# EAGLE design micromouse_board_revB_V0.0.8 (EAGLE 9.4.2)
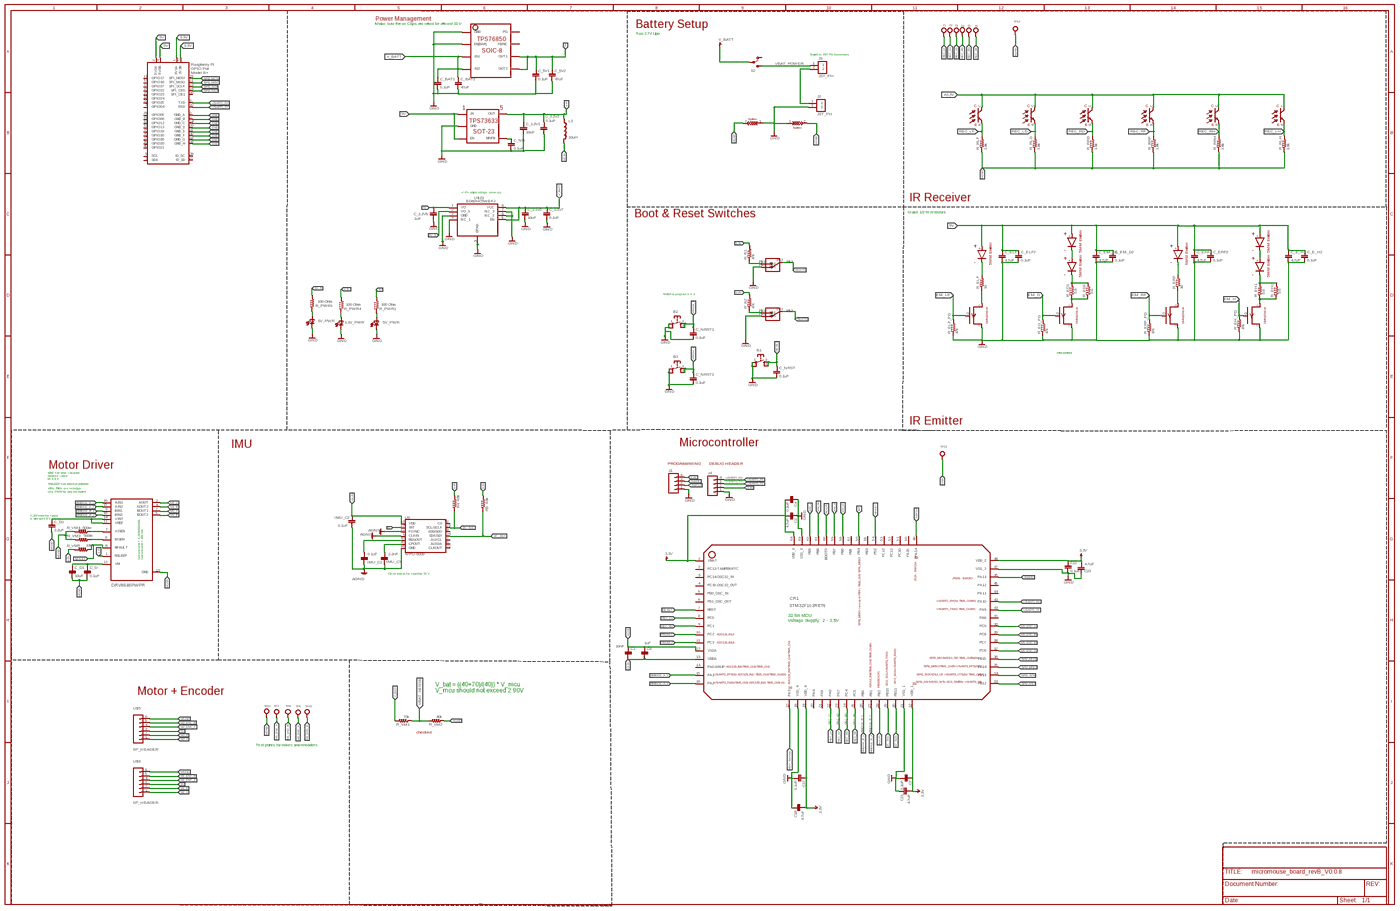
[diagram p0: schematic, sheet 1, overview]
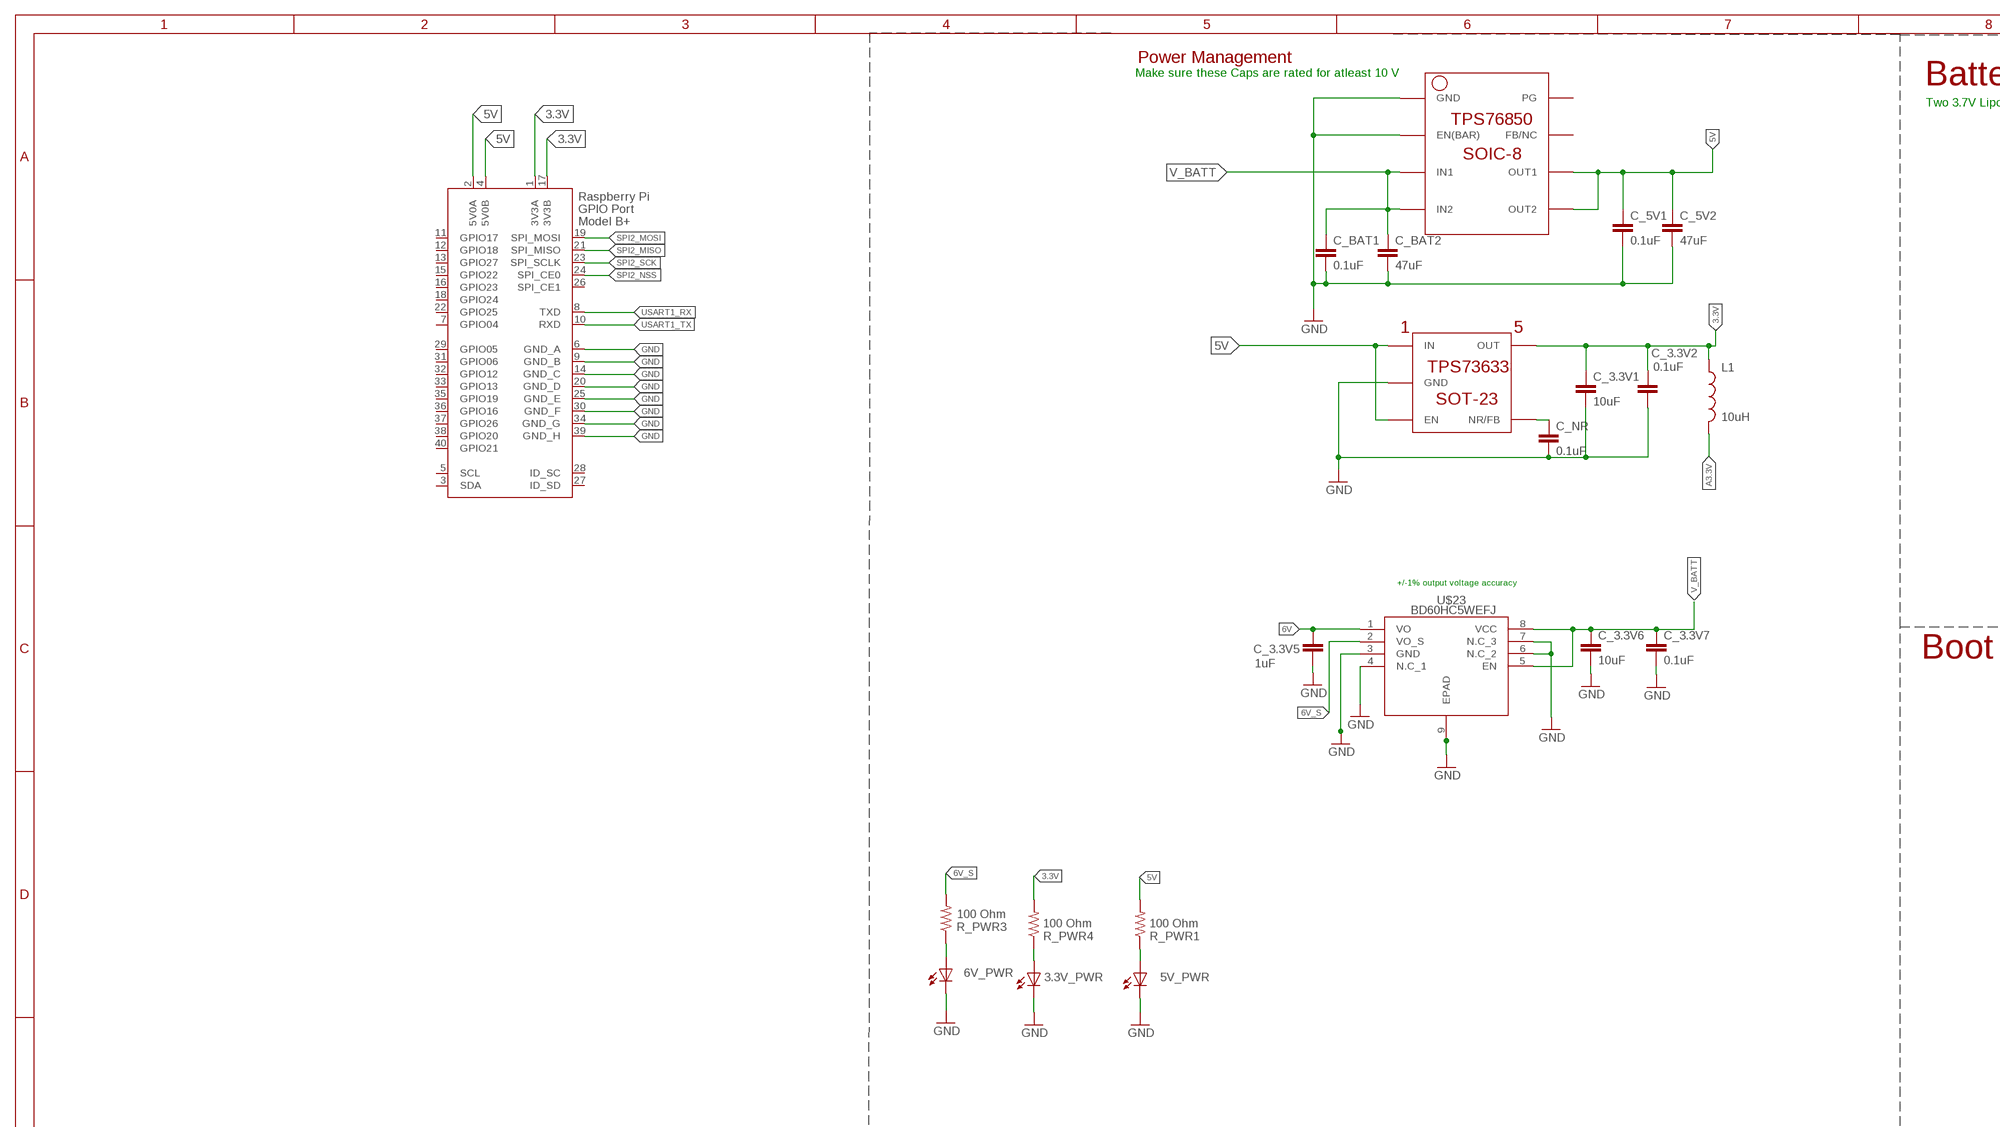
[diagram p1: schematic, sheet 1, part 1 of 4]
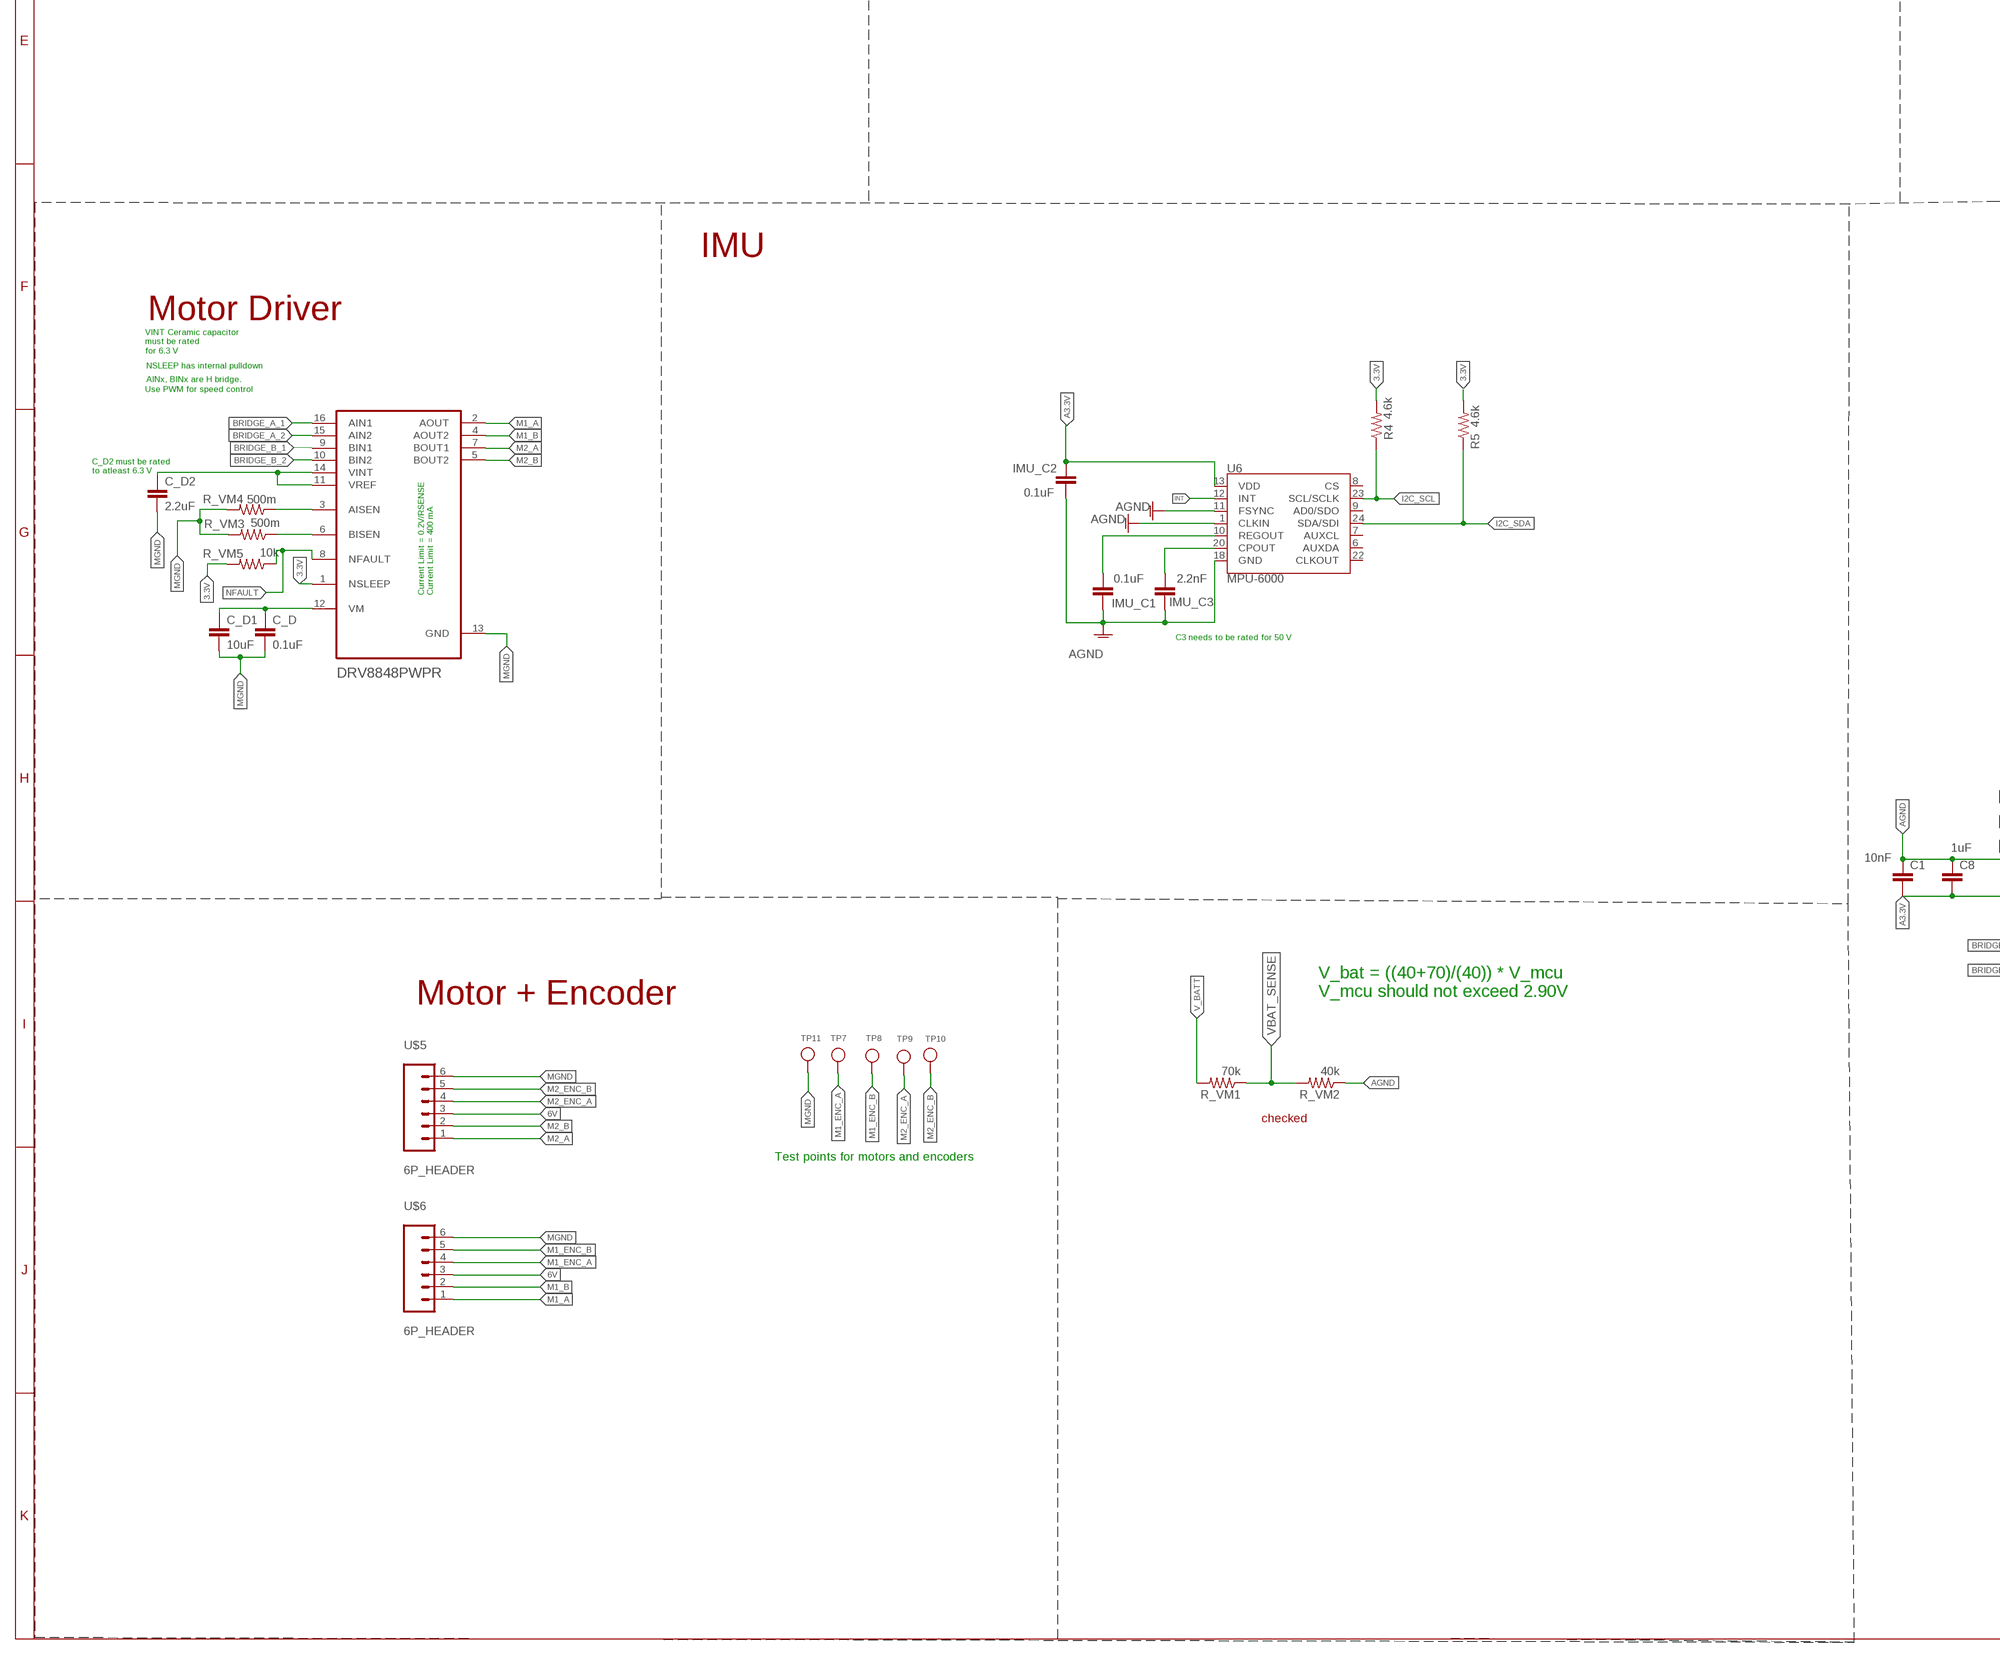
[diagram p2: schematic, sheet 1, part 2 of 4]
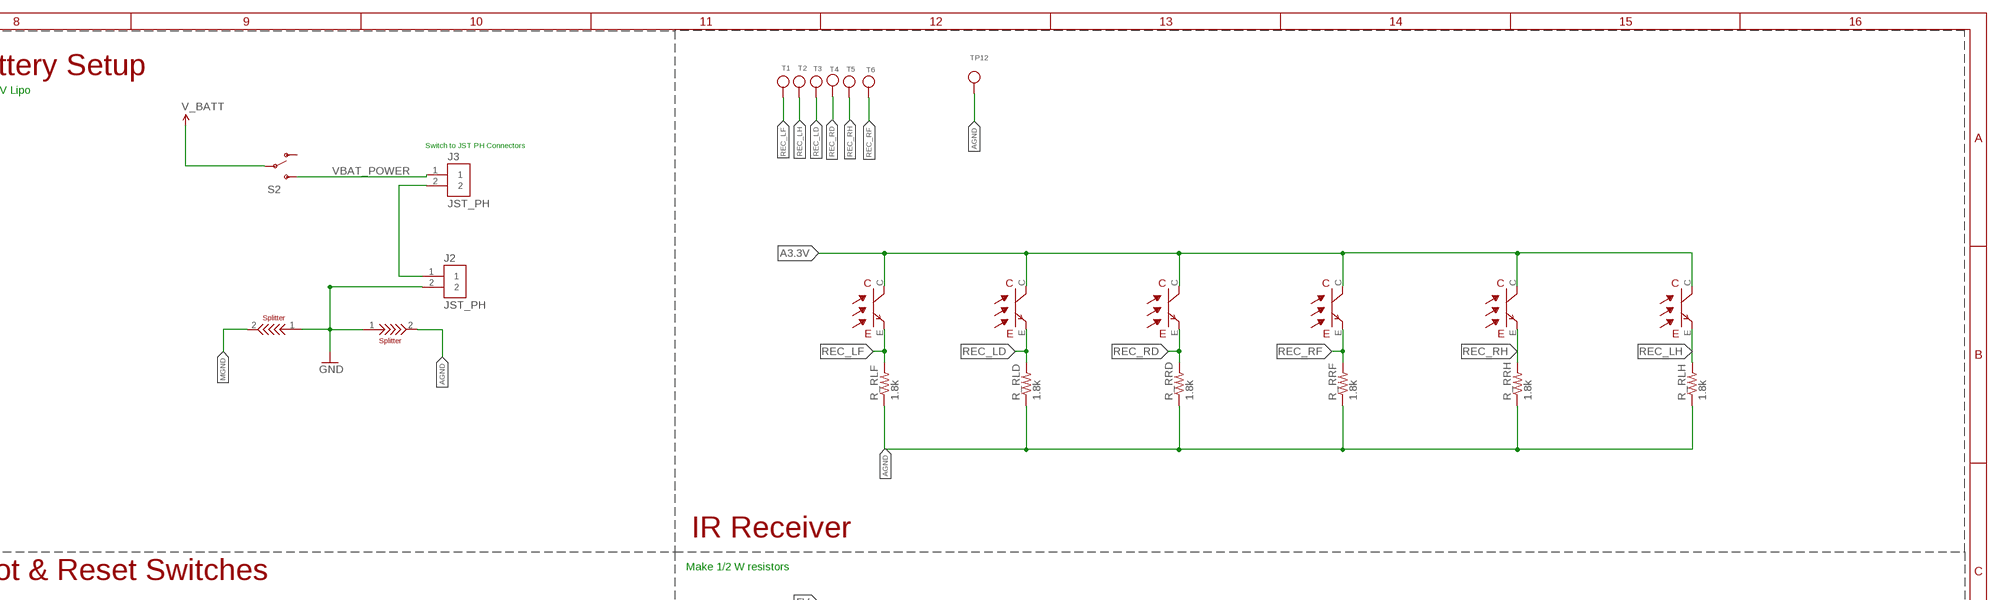
[diagram p3: schematic, sheet 1, part 3 of 4]
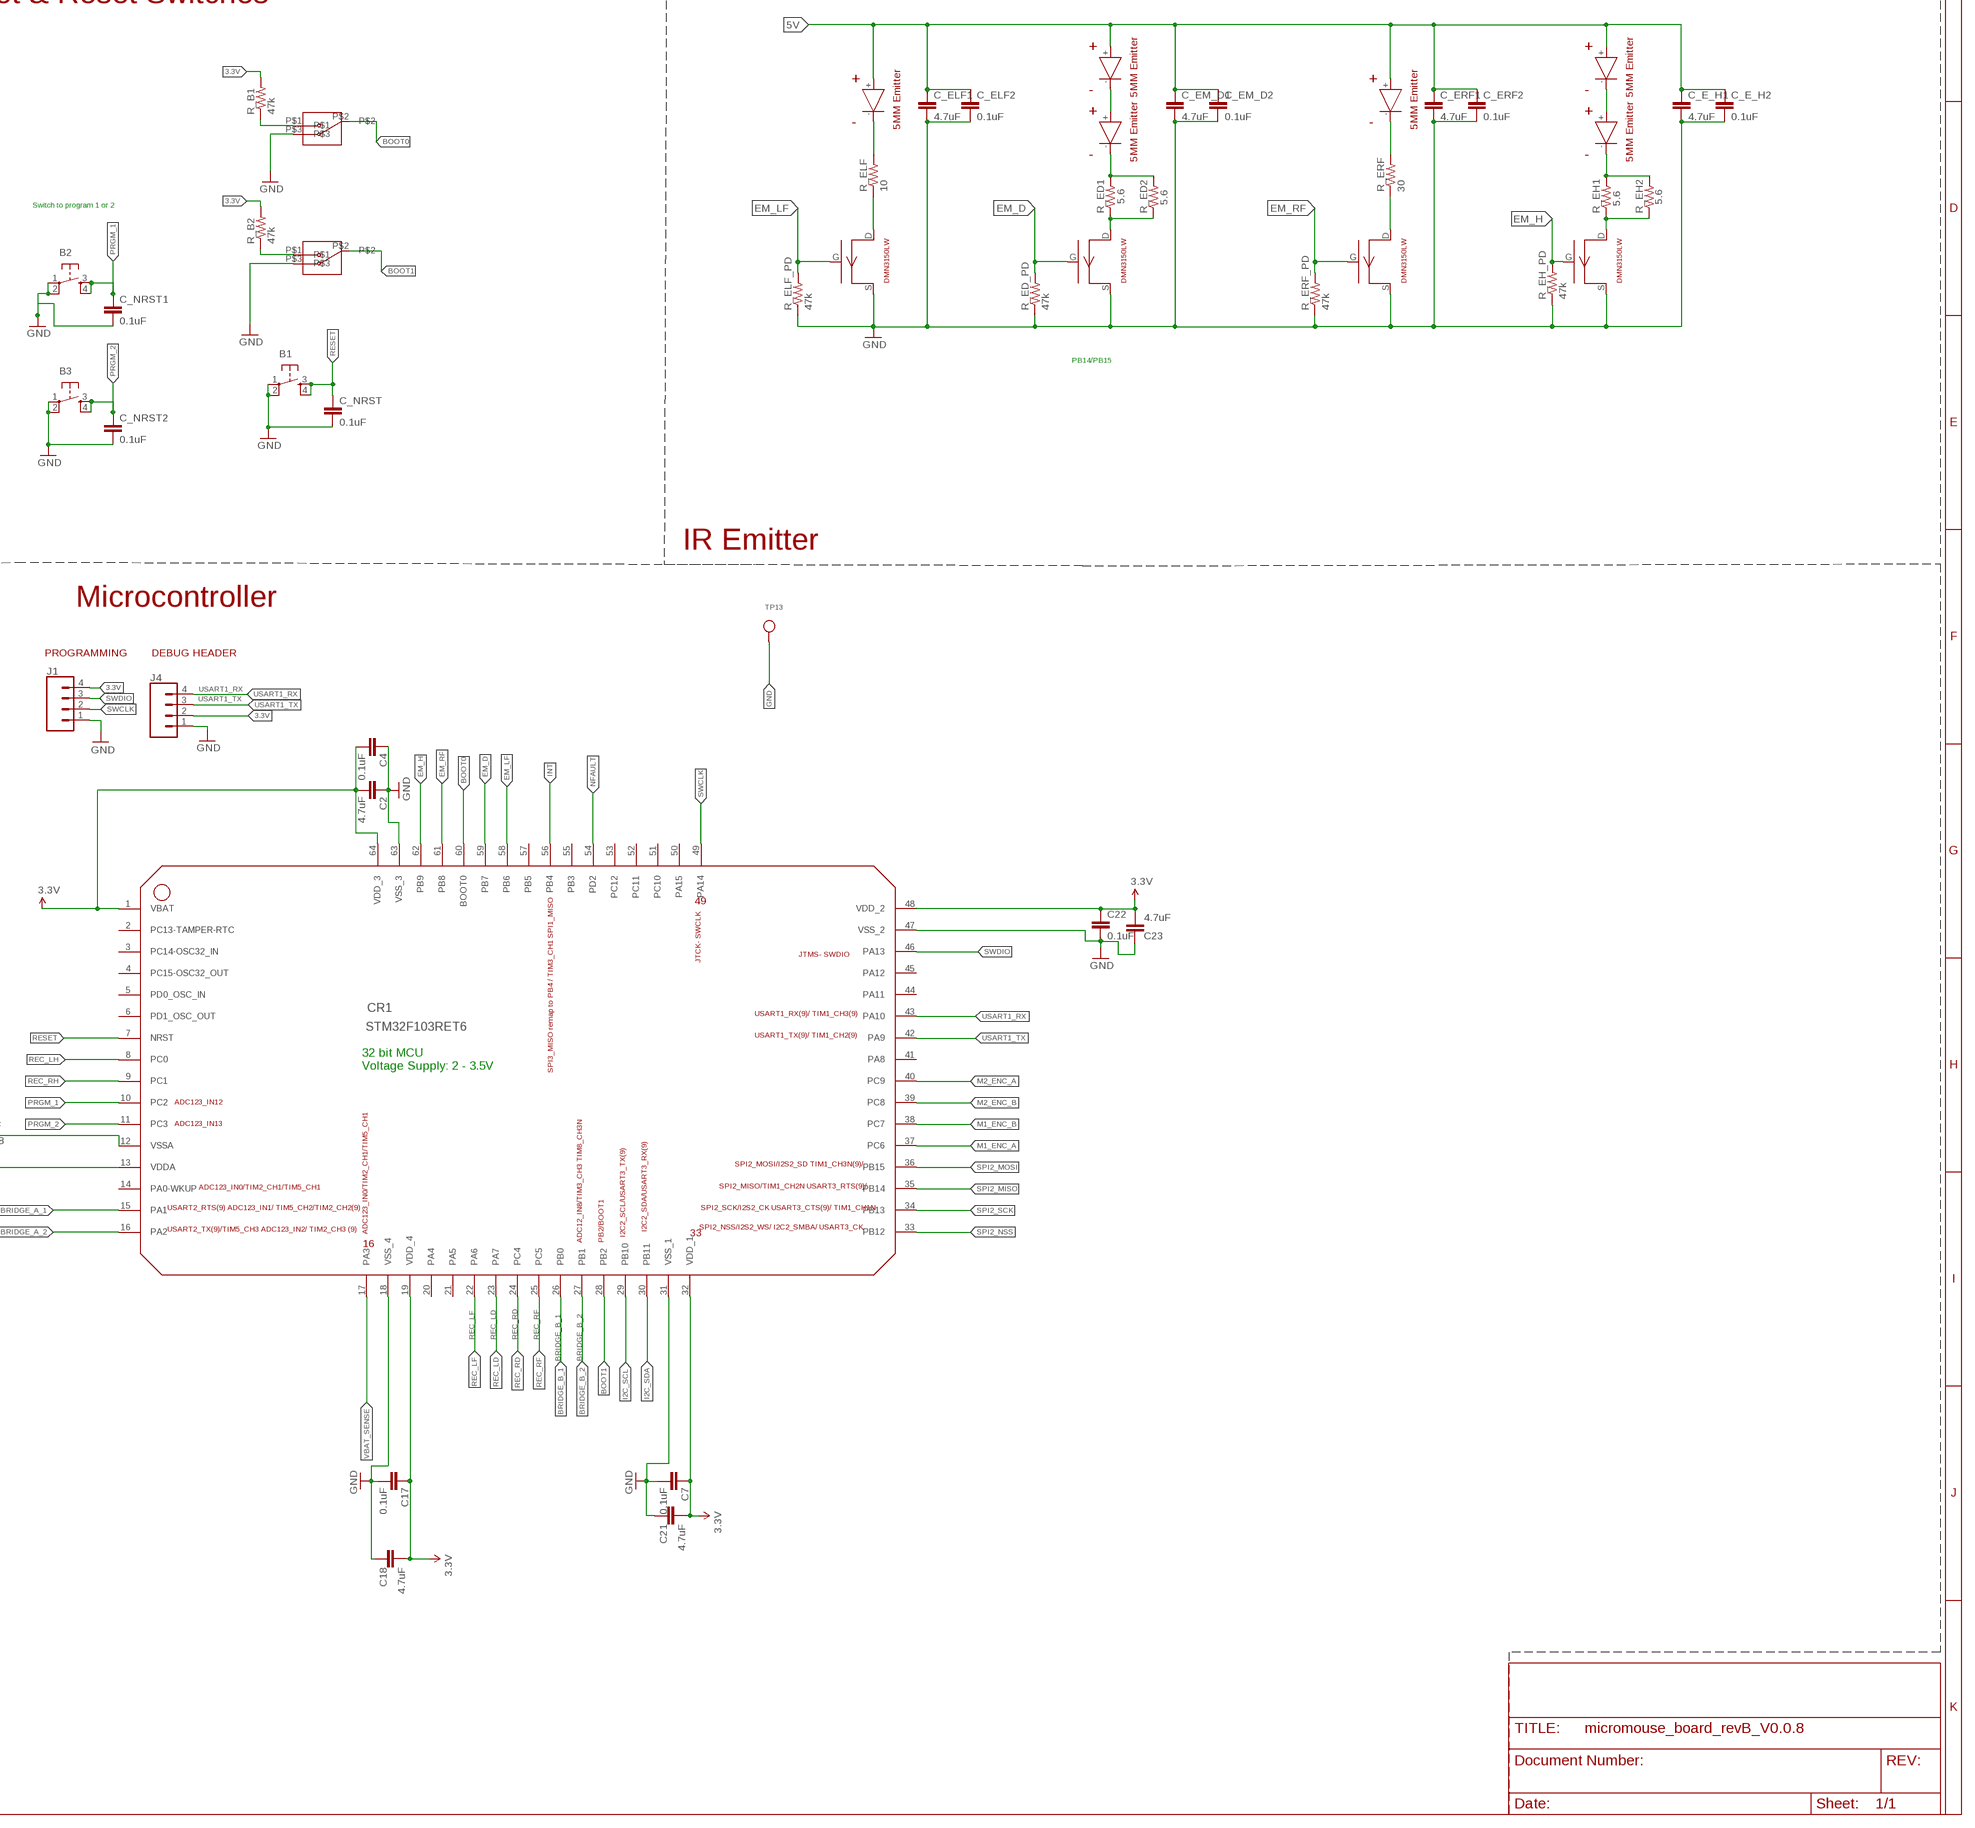
[diagram p4: schematic, sheet 1, part 4 of 4]

## Parts
3.3V_PWR  green  LED1206  [LED-1206]
5V_PWR  green  LED1206  [LED-1206]
6V_PWR  green  LED1206  [LED-1206]
B1  TAC_SWITCHSMD  [TACTILE-SWITCH-SMD]
B2  TAC_SWITCHSMD  [TACTILE-SWITCH-SMD]
B3  TAC_SWITCHSMD  [TACTILE-SWITCH-SMD]
C1  10nF  CAP0603-CAP  [0603-CAP]
C2  4.7uF  CAP0603-CAP  [0603-CAP]
C4  0.1uF  CAP0603-CAP  [0603-CAP]
C7  0.1uF  CAP0603-CAP  [0603-CAP]
C8  1uF  CAP0603-CAP  [0603-CAP]
C17  0.1uF  CAP0603-CAP  [0603-CAP]
C18  4.7uF  CAP0603-CAP  [0603-CAP]
C21  4.7uF  CAP0603-CAP  [0603-CAP]
C22  0.1uF  CAP0603-CAP  [0603-CAP]
C23  4.7uF  CAP0603-CAP  [0603-CAP]
C_3.3V1  10uF  CAP0603-CAP  [0603-CAP]
C_3.3V2  0.1uF  CAP0603-CAP  [0603-CAP]
C_3.3V5  1uF  CAP0603-CAP  [0603-CAP]
C_3.3V6  10uF  CAP0603-CAP  [0603-CAP]
C_3.3V7  0.1uF  CAP0603-CAP  [0603-CAP]
C_5V1  0.1uF  CAP0603-CAP  [0603-CAP]
C_5V2  47uF  CAP1210  [1210]
C_BAT1  0.1uF  CAP0603-CAP  [0603-CAP]
C_BAT2  47uF  CAP1210  [1210]
C_D  0.1uF  CAP0603-CAP  [0603-CAP]
C_D1  10uF  CAP0603-CAP  [0603-CAP]
C_D2  2.2uF  CAP0603-CAP  [0603-CAP]
C_E_H1  4.7uF  CAP0603-CAP  [0603-CAP]
C_E_H2  0.1uF  CAP0603-CAP  [0603-CAP]
C_ELF1  4.7uF  CAP0603-CAP  [0603-CAP]
C_ELF2  0.1uF  CAP0603-CAP  [0603-CAP]
C_EM_D1  4.7uF  CAP0603-CAP  [0603-CAP]
C_EM_D2  0.1uF  CAP0603-CAP  [0603-CAP]
C_ERF1  4.7uF  CAP0603-CAP  [0603-CAP]
C_ERF2  0.1uF  CAP0603-CAP  [0603-CAP]
C_NR  0.1uF  CAP0603-CAP  [0603-CAP]
C_NRST  0.1uF  CAP0603-CAP  [0603-CAP]
C_NRST1  0.1uF  CAP0603-CAP  [0603-CAP]
C_NRST2  0.1uF  CAP0603-CAP  [0603-CAP]
CR1  STM32F103RET6  [LQFP-64]
IMU_C1  0.1uF  CAP0603-CAP  [0603-CAP]
IMU_C2  0.1uF  CAP0603-CAP  [0603-CAP]
IMU_C3  2.2nF  CAP0603-CAP  [0603-CAP]
J1  CONN_04  [1X04]
J2  JST_PH  B2B-PH-K-S(LF)(SN)  [JST_B2B-PH-K-S(LF)(SN)]
J3  JST_PH  B2B-PH-K-S(LF)(SN)  [JST_B2B-PH-K-S(LF)(SN)]
J4  CONN_04  [1X04]
L1  10uH  INDUCTOR1007  [1007]
LEFT_FRONT_EMITTER  EMITTER  [EMITTER]
NMOS1  DMN3150LW  [DMN3150LW]
NMOS2  DMN3150LW  [DMN3150LW]
NMOS3  DMN3150LW  [DMN3150LW]
NMOS4  DMN3150LW  [DMN3150LW]
R4  4.6k  R-US_M0805  [M0805]
R5  4.6k  R-US_M0805  [M0805]
R_B1  47k  RESISTOR0603-RES  [0603-RES]
R_B2  47k  RESISTOR0603-RES  [0603-RES]
R_ED1  5.6  RESISTOR0603-RES  [0603-RES]
R_ED2  5.6  RESISTOR0603-RES  [0603-RES]
R_ED_PD  47k  RESISTOR0603-RES  [0603-RES]
R_EH1  5.6  RESISTOR0603-RES  [0603-RES]
R_EH2  5.6  RESISTOR0603-RES  [0603-RES]
R_EH_PD  47k  RESISTOR0603-RES  [0603-RES]
R_ELF  10  RESISTOR0603-RES  [0603-RES]
R_ELF_PD  47k  RESISTOR0603-RES  [0603-RES]
R_ERF  30  RESISTOR0603-RES  [0603-RES]
R_ERF_PD  47k  RESISTOR0603-RES  [0603-RES]
R_PWR1  100 Ohm  RESISTOR0603-RES  [0603-RES]
R_PWR3  100 Ohm  RESISTOR0603-RES  [0603-RES]
R_PWR4  100 Ohm  RESISTOR0603-RES  [0603-RES]
R_RLD  1.8k  RESISTOR0603-RES  [0603-RES]
R_RLF  1.8k  RESISTOR0603-RES  [0603-RES]
R_RLH  1.8k  RESISTOR0603-RES  [0603-RES]
R_RRD  1.8k  RESISTOR0603-RES  [0603-RES]
R_RRF  1.8k  RESISTOR0603-RES  [0603-RES]
R_RRH  1.8k  RESISTOR0603-RES  [0603-RES]
R_VM1  70k  RESISTOR0603-RES  [0603-RES]
R_VM2  40k  RESISTOR0603-RES  [0603-RES]
R_VM3  500m  RESISTOR0603-RES  [0603-RES]
R_VM4  500m  RESISTOR0603-RES  [0603-RES]
R_VM5  10k  RESISTOR0603-RES  [0603-RES]
REC_LF  RECEIVER  [RECEIVER]
S2  SWITCH-SPSTPTH  [SWITCH-SPDT]
T1  TESTPOINTROUND2MM  [TESTPOINT_ROUND_2MM]
T2  TESTPOINTROUND2MM  [TESTPOINT_ROUND_2MM]
T3  TESTPOINTROUND2MM  [TESTPOINT_ROUND_2MM]
T4  TESTPOINTROUND2MM  [TESTPOINT_ROUND_2MM]
T5  TESTPOINTROUND2MM  [TESTPOINT_ROUND_2MM]
T6  TESTPOINTROUND2MM  [TESTPOINT_ROUND_2MM]
TP7  TESTPOINTROUND2MM  [TESTPOINT_ROUND_2MM]
TP8  TESTPOINTROUND2MM  [TESTPOINT_ROUND_2MM]
TP9  TESTPOINTROUND2MM  [TESTPOINT_ROUND_2MM]
TP10  TESTPOINTROUND2MM  [TESTPOINT_ROUND_2MM]
TP11  TESTPOINTROUND2MM  [TESTPOINT_ROUND_2MM]
TP12  TESTPOINTROUND2MM  [TESTPOINT_ROUND_2MM]
TP13  TESTPOINTROUND2MM  [TESTPOINT_ROUND_2MM]
U2  DRV8848PWPR  [SOP65P640X120-17N]
U6  MPU-6000  [QFN-24-EP]
U$3  TPS73633(SOT-23)  [TPS73633(SOT-23)]
U$4  TPS76850(SOIC-8)  [TPS76850(SOIC-8)]
U$5  6P_HEADER  [6P_HEADER]
U$6  6P_HEADER  [6P_HEADER]
U$7  RECEIVER  [RECEIVER]
U$8  RECEIVER  [RECEIVER]
U$9  RECEIVER  [RECEIVER]
U$11  EMITTER  [EMITTER]
U$13  EMITTER  [EMITTER]
U$14  SPARKFUN-SPDT  [SPDT]
U$15  SPARKFUN-SPDT  [SPDT]
U$16  SPLITTER  [SPLITTER]
U$17  EMITTER  [EMITTER]
U$18  EMITTER  [EMITTER]
U$19  EMITTER  [EMITTER]
U$20  RECEIVER  [RECEIVER]
U$21  RECEIVER  [RECEIVER]
U$22  SPLITTER  [SPLITTER]
U$23  BD60HC5WEFJ  [SOIC127P600X100-9N]
X1  RASPI_GPIO_B+#_PIN  [RASPI_GPIO_B+_PIN]

## Nets
3.3V [3.3V]: C2.2 C4.2 C7.1 C17.1 C18.2 C21.2 C22.1 C23.2 C_3.3V1.1 C_3.3V2.1 CR1.1(VBAT) CR1.19(VDD_4) CR1.32(VDD_1) CR1.48(VDD_2) CR1.64(VDD_3) J1.4 J4.2 L1.1 R4.2 R5.2 R_B1.2 R_B2.2 R_PWR4.2 R_VM5.2 U2.1(NSLEEP) U$3.OUT X1.1(3V3A) X1.17(3V3B)
5V [5V]: C_5V1.1 C_5V2.1 C_E_H1.1 C_E_H2.1 C_ELF1.1 C_ELF2.1 C_EM_D1.1 C_EM_D2.1 C_ERF1.1 C_ERF2.1 LEFT_FRONT_EMITTER.+ R_PWR1.2 U$3.EN U$3.IN U$4.OUT1 U$4.OUT2 U$11.+ U$13.+ U$18.+ X1.2(5V0A) X1.4(5V0B)
6V [6V]: C_3.3V5.1 U$5.3 U$6.3 U$23.1(VO)
6V_S [6V_S]: R_PWR3.2 U$23.2(VO_S)
A3.3V: C1.2 C8.2 CR1.13(VDDA) IMU_C2.1 L1.2 REC_LF.C U6.13(VDD) U$7.C U$8.C U$9.C U$20.C U$21.C
AGND [AGND]: C1.1 C8.1 CR1.12(VSSA) IMU_C1.2 IMU_C2.2 IMU_C3.2 R_RLD.1 R_RLF.1 R_RLH.1 R_RRD.1 R_RRF.1 R_RRH.1 R_VM2.1 TP12.P$1 U6.1(CLKIN) U6.11(FSYNC) U6.18(GND) U$22.2
BOOT0: CR1.60(BOOT0) U$14.P$2
BOOT1: CR1.28(PB2) U$15.P$2
BRIDGE_A_1: CR1.15(PA1) U2.16(AIN1)
BRIDGE_A_2: CR1.16(PA2) U2.15(AIN2)
BRIDGE_B_1: CR1.26(PB0) U2.9(BIN1)
BRIDGE_B_2: CR1.27(PB1) U2.10(BIN2)
D2_EM: R_ED1.2 R_ED2.2 U$17.-
D_EM: U$11.- U$17.+
EM_D: CR1.59(PB7) NMOS2.G R_ED_PD.2
EM_H: CR1.62(PB9) NMOS4.G R_EH_PD.2
EM_LF: CR1.58(PB6) NMOS1.G R_ELF_PD.2
EM_RF: CR1.61(PB8) NMOS3.G R_ERF_PD.2
GND [GND]: 3.3V_PWR.C 5V_PWR.C 6V_PWR.C B1.1 B1.2 B2.1 B2.2 B3.1 B3.2 C2.1 C4.1 C7.2 C17.2 C18.1 C21.1 C22.2 C23.1 C_3.3V1.2 C_3.3V2.2 C_3.3V5.2 C_3.3V6.2 C_3.3V7.2 C_5V1.2 C_5V2.2 C_BAT1.2 C_BAT2.2 C_E_H1.2 C_E_H2.2 C_ELF1.2 C_ELF2.2 C_EM_D1.2 C_EM_D2.2 C_ERF1.2 C_ERF2.2 C_NR.2 C_NRST1.2 C_NRST2.2 C_NRST.2 CR1.18(VSS_4) CR1.31(VSS_1) CR1.47(VSS_2) CR1.63(VSS_3) J1.1 J2.2 J4.1 NMOS1.S NMOS2.S NMOS3.S NMOS4.S R_ED_PD.1 R_EH_PD.1 R_ELF_PD.1 R_ERF_PD.1 TP13.P$1 U$3.GND U$4.EN(BAR) U$4.GND U$14.P$3 U$15.P$3 U$16.1 U$22.1 U$23.3(GND) U$23.4(N.C_1) U$23.6(N.C_2) U$23.7(N.C_3) U$23.9(EPAD) X1.6(GND_A) X1.9(GND_B) X1.14(GND_C) X1.20(GND_D) X1.25(GND_E) X1.30(GND_F) X1.34(GND_G) X1.39(GND_H)
H2_EM: R_EH1.2 R_EH2.2 U$19.-
H_EM: U$18.- U$19.+
I2C_SCL: CR1.29(PB10) R4.1 U6.23(SCL/SCLK)
I2C_SDA: CR1.30(PB11) R5.1 U6.24(SDA/SDI)
INT: CR1.56(PB4) U6.12(INT)
LF_EM: LEFT_FRONT_EMITTER.- R_ELF.2
M1_A [M1]: U2.2(AOUT) U$6.1
M1_B [M1]: U2.4(AOUT2) U$6.2
M1_ENC_A: CR1.37(PC6) TP7.P$1 U$6.4
M1_ENC_B: CR1.38(PC7) TP8.P$1 U$6.5
M2_A [M2]: U2.7(BOUT1) U$5.1
M2_B [M2]: U2.5(BOUT2) U$5.2
M2_ENC_A: CR1.40(PC9) TP9.P$1 U$5.4
M2_ENC_B: CR1.39(PC8) TP10.P$1 U$5.5
MGND [MGND]: C_D1.2 C_D2.2 C_D.2 R_VM3.2 R_VM4.2 TP11.P$1 U2.13(GND) U$5.6 U$6.6 U$16.2
N$1: 3.3V_PWR.A R_PWR4.1
N$2: R_VM4.1 U2.3(AISEN)
N$3: J2.1 J3.2
N$4: R_B2.1 U$15.P$1
N$5: NMOS3.D R_ERF.1
N$6: R_B1.1 U$14.P$1
N$7: NMOS1.D R_ELF.1
N$8: R_VM3.1 U2.6(BISEN)
N$9: 6V_PWR.A R_PWR3.1
N$10: C_D1.1 C_D.1 U2.12(VM)
N$11: C_D2.1 U2.11(VREF) U2.14(VINT)
N$14: 5V_PWR.A R_PWR1.1
N$18: NMOS2.D R_ED1.1 R_ED2.1
N$19: NMOS4.D R_EH1.1 R_EH2.1
N$26: C_NR.1 U$3.NR/FB
N$28: IMU_C1.1 U6.10(REGOUT)
N$29: IMU_C3.1 U6.20(CPOUT)
NFAULT: CR1.54(PD2) R_VM5.1 U2.8(NFAULT)
PRGM_1: B2.3 B2.4 C_NRST1.1 CR1.10(PC2)
PRGM_2: B3.3 B3.4 C_NRST2.1 CR1.11(PC3)
REC_LD: CR1.23(PA7) R_RLD.2 T3.P$1 U$7.E
REC_LF: CR1.22(PA6) R_RLF.2 REC_LF.E T1.P$1
REC_LH: CR1.8(PC0) R_RLH.2 T2.P$1 U$21.E
REC_RD: CR1.24(PC4) R_RRD.2 T4.P$1 U$8.E
REC_RF: CR1.25(PC5) R_RRF.2 T6.P$1 U$9.E
REC_RH: CR1.9(PC1) R_RRH.2 T5.P$1 U$20.E
RESET: B1.3 B1.4 C_NRST.1 CR1.7(NRST)
RF_EM: R_ERF.2 U$13.-
SPI2_MISO: CR1.35(PB14) X1.21(SPI_MISO)
SPI2_MOSI: CR1.36(PB15) X1.19(SPI_MOSI)
SPI2_NSS: CR1.33(PB12) X1.24(SPI_CE0)
SPI2_SCK: CR1.34(PB13) X1.23(SPI_SCLK)
SWCLK: CR1.49(PA14) J1.2
SWDIO: CR1.46(PA13) J1.3
USART1_RX: CR1.43(PA10) J4.4 X1.8(TXD)
USART1_TX: CR1.42(PA9) J4.3 X1.10(RXD)
V_BATT [V_BATT]: C_3.3V6.1 C_3.3V7.1 C_BAT1.1 C_BAT2.1 R_VM1.2 S2.2(P) U$4.IN1 U$4.IN2 U$23.5(EN) U$23.8(VCC)
VBAT_POWER [V_BATT]: J3.1 S2.3(S)
VBAT_SENSE: CR1.17(PA3) R_VM1.1 R_VM2.2
Unconnected: CR1.2(PC13-TAMPER-RTC) CR1.3(PC14-OSC32_IN) CR1.4(PC15-OSC32_OUT) CR1.5(PD0_OSC_IN) CR1.6(PD1_OSC_OUT) CR1.14(PA0-WKUP) CR1.20(PA4) CR1.21(PA5) CR1.41(PA8) CR1.44(PA11) CR1.45(PA12) CR1.50(PA15) CR1.51(PC10) CR1.52(PC11) CR1.53(PC12) CR1.55(PB3) CR1.57(PB5) S2.1(O) U6.6(AUXDA) U6.7(AUXCL) U6.8(CS) U6.9(AD0/SDO) U6.22(CLKOUT) U$4.FB/NC U$4.PG X1.3(SDA) X1.5(SCL) X1.7(GPIO04) X1.11(GPIO17) X1.12(GPIO18) X1.13(GPIO27) X1.15(GPIO22) X1.16(GPIO23) X1.18(GPIO24) X1.22(GPIO25) X1.26(SPI_CE1) X1.27(ID_SD) X1.28(ID_SC) X1.29(GPIO05) X1.31(GPIO06) X1.32(GPIO12) X1.33(GPIO13) X1.35(GPIO19) X1.36(GPIO16) X1.37(GPIO26) X1.38(GPIO20) X1.40(GPIO21)

## Notes on the sheet
- Power Management
- Make sure these Caps are rated for atleast 10 V
- Battery Setup
- Two 3.7V Lipo
- Switch to JST PH Connectors
- +/-1% output voltage accuracy
- IR Receiver
- Make 1/2 W resistors
- Boot & Reset Switches
- Switch to program 1 or 2
- PB14/PB15
- IR Emitter
- IMU | Microcontroller
- PROGRAMMING        DEBUG HEADER
- Motor Driver
- VINT Ceramic capacitor 
  must be rated 
  for 6.3 V
- NSLEEP has internal pulldown
- AINx, BINx are H bridge.
- Use PWM for speed control
- C_D2 must be rated
  to atleast 6.3 V
- SPI3_MISO remap to PB4 / TIM3_CH1 SPI1_MISO
- Current Limit = 0.2V/RSENSE
  Current Limit = 400 mA
- C3 needs to be rated for 50 V
- JTMS- SWDIO
- JTCK- SWCLK
- USART1_RX(9)/ TIM1_CH3(9)
- USART1_TX(9)/ TIM1_CH2(9)
- 32 bit MCU
  Voltage Supply: 2 - 3.5V
- ADC123_IN12
- ADC123_IN13
- SPI2_MOSI/I2S2_SD TIM1_CH3N(9)/
- ADC123_IN0/TIM2_CH1/TIM5_CH1 | SPI2_MISO/TIM1_CH2N USART3_RTS(9)/
- USART2_RTS(9) ADC123_IN1/ TIM5_CH2/TIM2_CH2(9) | SPI2_SCK/I2S2_CK USART3_CTS(9)/ TIM1_CH1N
- SPI2_NSS/I2S2_WS/ I2C2_SMBA/ USART3_CK
- USART2_TX(9)/TIM5_CH3 ADC123_IN2/ TIM2_CH3 (9) | ADC123_IN0/TIM2_CH1/TIM5_CH1 | I2C2_SDA/USART3_RX(9)
- I2C2_SCL/USART3_TX(9)
- ADC12_IN8/TIM3_CH3 TIM8_CH3N | PB2/BOOT1
- V_bat = ((40+70)/(40)) * V_mcu
  V_mcu should not exceed 2.90V
- Motor + Encoder
- checked
- Test points for motors and encoders

## Library data of the parts
3.3V_PWR 5V_PWR 6V_PWR = micromouse-board-added-piconnector:LED: LEDs Standard schematic elements and footprints for 5mm, 3mm, 1206, and 0603 sized LEDs. 5mm - Spark Fun Electronics SKU : COM-00529 (and others)
B1-B3 = SparkFun-Retired:TAC_SWITCH: Momentary Switch Button commonly used for reset or general input. Spark Fun Electronics SKU : COM-00097 SMT- SWCH-08247; PROD_ID: SWCH-08247; VALUE: TAC_SWITCHSMD
C1 C2 C4 C7 C8 C17 C18 C21-C23 C_3.3V1 C_3.3V2 C_3.3V5-C_3.3V7 C_5V1 C_5V2 C_BAT1 C_BAT2 C_D C_D1 C_D2 C_E_H1 C_E_H2 C_ELF1 C_ELF2 C_EM_D1 C_EM_D2 C_ERF1 C_ERF2 C_NR IMU_C1-IMU_C3 = micromouse-board-added-piconnector:CAP: Capacitor Standard 0603 ceramic capacitor, and 0.1" leaded capacitor.
C_NRST C_NRST1 C_NRST2 = SparkFun:CAP: Capacitor Standard 0603 ceramic capacitor, and 0.1" leaded capacitor.
CR1 = micromouse-board-added-piconnector:STM32F103RET6; MANUFACTURER_PART_NUMBER: STM32F103RET6; VENDOR: STMicroelectronics
J1 J4 = micromouse-board-added-piconnector:CONN_04: Multi connection point. Often used as Generic Header-pin footprint for 0.1 inch spaced/style header connections On any of the 0.1 inch spaced packages, you can populate with these: Break Away Headers - Straight <https://www.sparkfun.com/products/116> (PRT-00116) Break Away Male Headers - Right Angle <https://www.sparkfun.com/products/553> (PRT-00553) Female Headers <https://www.sparkfun.com/products/115> (PRT-00115) Break Away Headers - Machine Pin <https://www.sparkfun.com/products/117> (PRT-00117) Break Away Female Headers - Swiss Machine Pin <https://www.sparkfun.com/products/743> (PRT-00743) For SCREWTERMINALS and SPRING TERMINALS visit here: Screw Terimnals on SparkFun.com <https://www.sparkfun.com/search/results?term=Screw+Terminals> (5mm/3.5mm/2.54mm spacing) This device is also useful as a general connection point to wire up your design to another part of your project. Our various solder wires solder well into these plated through hole pads. Hook-Up Wire - Assortment (Stranded, 22 AWG) <https://www.sparkfun.com/products/11375> (PRT-11375) Hook-Up Wire - Assortment (Solid Core, 22 AWG) <https://www.sparkfun.com/products/11367> (PRT-11367) View the entire wire category on our website here <https://www.sparkfun.com/categories/141> Special notes: Molex polarized connector foot print use with SKU : PRT-08231 with associated crimp pins and housings. 1MM SMD Version SKU: PRT-10208; PROD_ID: CONN-09696
J2 J3 = B2B-PH-K-S_LF__SN_:B2B-PH-K-S(LF)(SN): PH Series 2 Position 2 mm Pitch Through Hole Top Entry Shrouded Header; DESCRIPTION: Connector Header Through Hole 2 position 0.079 _2.00mm_; MF: JST Sales; MP: B2B-PH-K-S_LF__SN_; PACKAGE: None
L1 = SparkFun-Passives:INDUCTOR: Inductors Basic Inductor/Choke - 0603 and 1206. Footprints are not proven and vary greatly between part numbers. INDUCTOR POWER 3.3UH 4.0A SMD 0.197" L x 0.197" W x 0.177" H (5.00mm x 5.00mm x 4.50mm)
LEFT_FRONT_EMITTER U$11 U$13 U$17-U$19 = micromouse-board-added-piconnector:EMITTER
NMOS1-NMOS4 = micromouse-board-added-piconnector:DMN3150LW
R4 R5 = rcl:R-US_: RESISTOR, American symbol; SPICEPREFIX: R
R_B1 R_B2 = SparkFun-Passives:RESISTOR: Resistor Basic schematic elements and footprints for 0603, 1206, and PTH resistors.
R_ED1 R_ED2 R_ED_PD R_EH1 R_EH2 R_EH_PD R_ELF R_ELF_PD R_ERF R_ERF_PD R_PWR1 R_PWR3 R_PWR4 R_RLD R_RLF R_RLH R_RRD R_RRF R_RRH R_VM1-R_VM5 = micromouse-board-added-piconnector:RESISTOR: Resistor Basic schematic elements and footprints for 0603, 1206, and PTH resistors.
REC_LF U$7-U$9 U$20 U$21 = micromouse-board-added-piconnector:RECEIVER
S2 = micromouse-board-added-piconnector:SWITCH-SPST: SPST Switch Simple slide switch. Spark Fun Electronics SKU : COM-00102
T1-T6 TP7-TP13 = micromouse-board-added-piconnector:TESTPOINT: Test Point Various test points for characterisation and PCB testing TESTPOINT_SMT - Compact Surface Mount Test Point [Digikey: 5016KTR-ND]
U2 = micromouse-board-added-piconnector:DRV8848PWPR: None; AVAILABILITY: Unavailable; DESCRIPTION: 2A Dual H-Bridge Motor Driver _PWM Control_ 16-HTSSOP -40 to 85; MF: Texas Instruments; MP: DRV8848PWPR; PACKAGE: HTSSOP-16 Texas Instruments; PRICE: None
U6 = micromouse-board-added-piconnector:MPU-6000: Invensense MPU-6000 6-Axis Gryoscope/Accelerometer 3-axis gyroscope, 3-axis accelerometer in a 4x4 package. The MPU-6000 is the world’s first 6-axis I²C MotionTracking device designed for the low power, low cost, and high performance requirements of smartphones, tablets and wearable sensors. Datasheet <http://cdn.sparkfun.com/datasheets/Components/General%20IC/PS-MPU-6000A.pdf> SparkFun Products MPU-6000 - Motion Processing Unit <https://www.sparkfun.com/products/11234> (SEN-11234) SparkFun UDB5 - PIC UAV Development Board <https://www.sparkfun.com/products/11703> (GPS-11703); PROD_ID: IC-11089; SF_ID: SEN-11234
U$3 = micromouse-board-added-piconnector:TPS73633(SOT-23)
U$4 = micromouse-board-added-piconnector:TPS76850(SOIC-8)
U$5 U$6 = micro-motor:6P_HEADER: Generic 6P header
U$14 U$15 = micro-motor:SPARKFUN-SPDT
U$16 U$22 = splitter:SPLITTER
U$23 = BD33FC0WEFJ-E2:BD60HC5WEFJ
X1 = raspberrypi_bastelstube_v13:RASPI_GPIO_B+#: 2x20 header connector, all pins connected

## Net classes
0 default: width 0.254 mm, drill 0.254 mm, clearance 0.203 mm
1 5V: width 0.508 mm, drill 0.254 mm, clearance 0.254 mm
2 6V: width 0.762 mm, drill 0.508 mm, clearance 0.254 mm
3 6V_S: width 0.762 mm, drill 0.508 mm, clearance 0.254 mm
4 V_BATT: width 0.762 mm, drill 0.508 mm, clearance 0.254 mm
5 3.3V: width 0.254 mm, drill 0.254 mm, clearance 0.203 mm
6 MGND: width 0.305 mm, drill 0.305 mm, clearance 0.254 mm
7 AGND: width 0.254 mm, drill 0.305 mm, clearance 0.203 mm
8 GND: width 0.305 mm, drill 0.203 mm, clearance 0.305 mm
9 M1: width 0.254 mm, drill 0.254 mm, clearance 0.203 mm
10 M2: width 0.254 mm, drill 0.254 mm, clearance 0.203 mm

## Board
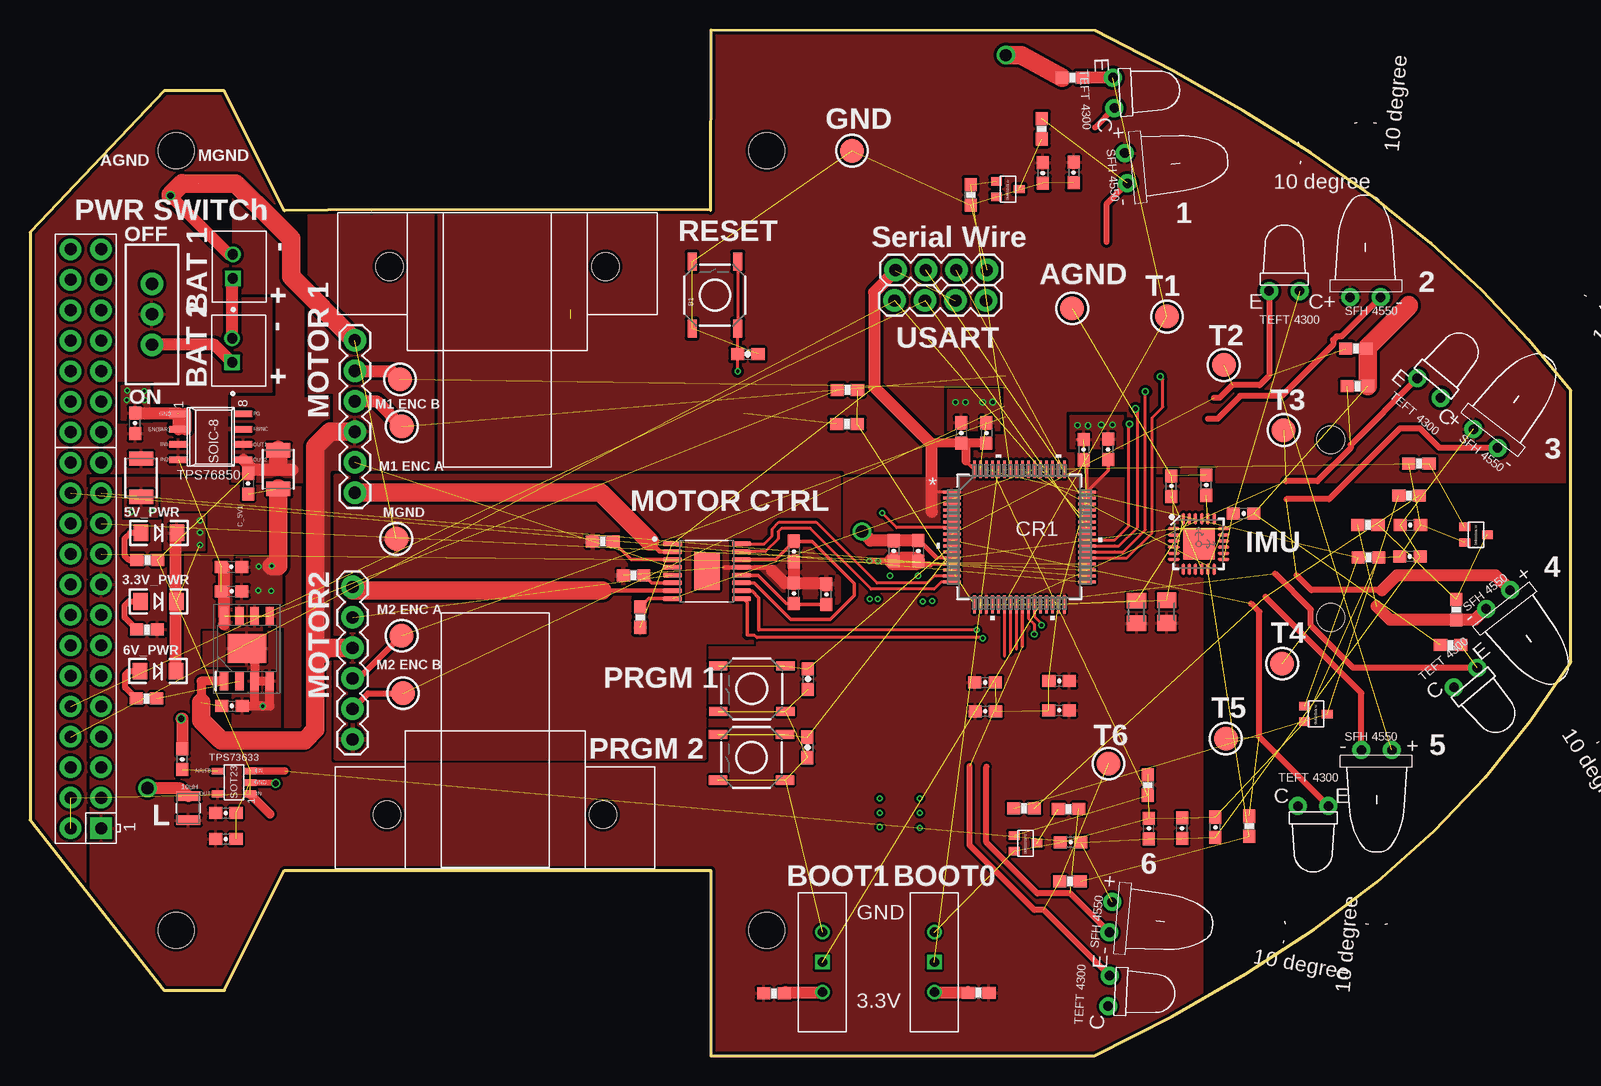
[diagram p5: board, top side]
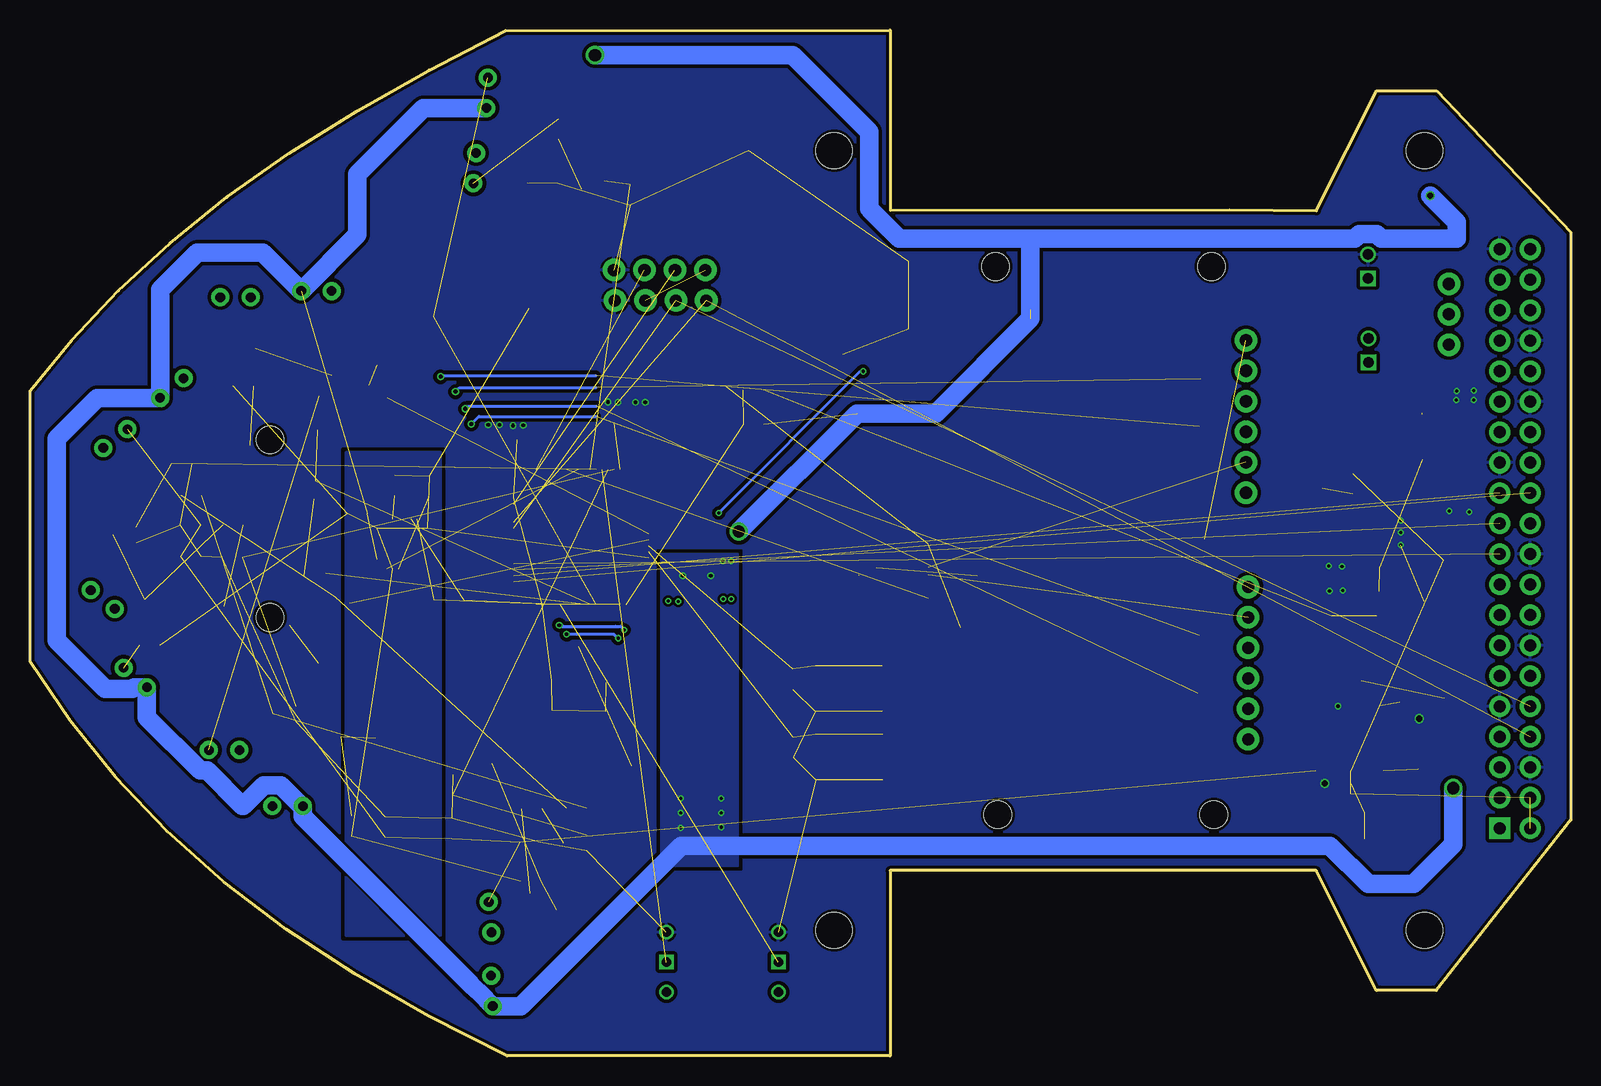
[diagram p6: board, bottom side, seen from below]

Size 128.4 x 85.52 mm. Coordinates in mm from the lower left corner, seen from the top.
Outline: 56.73,15.45 56.73,0 88.67,0 95.19,3.31 101.32,6.82 107.03,10.54 112.27,14.51 117.01,18.73 121.25,23.21 125.04,27.92 128.4,32.85 128.4,55.45 124.91,59.68 121.03,63.79 116.73,67.75 111.98,71.57 106.78,75.24 101.15,78.77 95.14,82.18 88.79,85.47 56.73,85.52 56.71,70.48 28.44,70.53 21.2,70.45 16.19,80.45 11.18,80.45 0,68.65 0,19.65 11.2,5.45 16.2,5.45 21.2,15.45 56.73,15.45
Copper layers (1*16): Top 0.018mm / dielectric 1.55mm / Bottom 0.018mm
Design rules "eC_2Layer_PClass6_BaseCopperO18_eCDefault *": minimum track width 8mil, minimum drill 10mil, track to track 8mil, track to pad 8mil, pad to pad 8mil, via to via 8mil, smd to smd 8mil, copper to edge 0.25mm, drill to drill 0.35mm, minimum pad ring 0.175mm, minimum via ring 0.125mm, stop-mask expansion 0mil, vias tented up to drill 0.45mm, thermal gap 0.2mm
Holes 3 mm at 12.2,10.45 12.2,75.45 61.4,10.45 61.4,75.45
Holes 2.3 mm at 108.4,36.55 108.4,51.35 29.75,20.1 47.75,20.1 47.95,65.8 29.95,65.8
tKeepout: area 34.3,15.9 to 43,36.9; area 34.5,49.3 to 43.2,70.3

### Footprints (pad centres in the part's own frame; a part is rotated, then mirrored left to right if it is on the bottom)
LED-1206 = smd 1.2 x 1.4: A -1.5,0; C 1.5,0
TACTILE-SWITCH-SMD = smd 1.524 x 0.762: 1 -2.794,1.905; 2 2.794,1.905; 3 -2.794,-1.905; 4 2.794,-1.905
0603-CAP = smd 1.1 x 1: 1 -0.85,0; 2 0.85,0
1210 = smd 1.2 x 2: 1 -1.6,0; 2 1.6,0
LQFP-64 = smd 1.473 x 0.229: 1 -5.626,3.75; 2 -5.626,3.25; 3 -5.626,2.75; 4 -5.626,2.25; 5 -5.626,1.75; 6 -5.626,1.25; 7 -5.626,0.75; 8 -5.626,0.25; 9 -5.626,-0.25; 10 -5.626,-0.75; 11 -5.626,-1.25; 12 -5.626,-1.75; 13 -5.626,-2.25; 14 -5.626,-2.75; 15 -5.626,-3.25; 16 -5.626,-3.75; 33 5.626,-3.75; 34 5.626,-3.25; 35 5.626,-2.75; 36 5.626,-2.25; 37 5.626,-1.75; 38 5.626,-1.25; 39 5.626,-0.75; 40 5.626,-0.25; 41 5.626,0.25; 42 5.626,0.75; 43 5.626,1.25; 44 5.626,1.75; 45 5.626,2.25; 46 5.626,2.75; 47 5.626,3.25; 48 5.626,3.75 | smd 0.229 x 1.473: 17 -3.75,-5.626; 18 -3.25,-5.626; 19 -2.75,-5.626; 20 -2.25,-5.626; 21 -1.75,-5.626; 22 -1.25,-5.626; 23 -0.75,-5.626; 24 -0.25,-5.626; 25 0.25,-5.626; 26 0.75,-5.626; 27 1.25,-5.626; 28 1.75,-5.626; 29 2.25,-5.626; 30 2.75,-5.626; 31 3.25,-5.626; 32 3.75,-5.626; 49 3.75,5.626; 50 3.25,5.626; 51 2.75,5.626; 52 2.25,5.626; 53 1.75,5.626; 54 1.25,5.626; 55 0.75,5.626; 56 0.25,5.626; 57 -0.25,5.626; 58 -0.75,5.626; 59 -1.25,5.626; 60 -1.75,5.626; 61 -2.25,5.626; 62 -2.75,5.626; 63 -3.25,5.626; 64 -3.75,5.626
1X04 = drill 1.016 pad 1.88: 1 0,0; 2 2.54,0; 3 5.08,0; 4 7.62,0
JST_B2B-PH-K-S(LF)(SN) = drill 0.86 square: 1 1,-0.55 | drill 0.86: 2 -1,-0.55
1007 = smd 2 x 0.8: 1 0,1; 2 0,-1
EMITTER = drill 0.8 pad 1.5: + -1.27,-0.5; - 1.27,-0.5
DMN3150LW = smd 0.7 x 0.9: D 0,0.95; G -0.65,-0.95; S 0.65,-0.95
M0805 = smd 1.3 x 1.6: 1 -0.95,0; 2 0.95,0
0603-RES = smd 1.1 x 1: 1 -0.85,0; 2 0.85,0
RECEIVER = drill 0.8 pad 1.5: C 1.27,-0.5; E -1.27,-0.5
SWITCH-SPDT = drill 1.016 pad 1.88: 1 0,2.54; 2 0,0; 3 0,-2.54
TESTPOINT_ROUND_2MM = smd 2 x 2: P$1 0,0
SOP65P640X120-17N = smd 1.57 x 0.41: 1 -2.87,2.275; 2 -2.87,1.625; 3 -2.87,0.975; 4 -2.87,0.325; 5 -2.87,-0.325; 6 -2.87,-0.975; 7 -2.87,-1.625; 8 -2.87,-2.275; 9 2.87,-2.275; 10 2.87,-1.625; 11 2.87,-0.975; 12 2.87,-0.325; 13 2.87,0.325; 14 2.87,0.975; 15 2.87,1.625; 16 2.87,2.275 | smd 2.105 x 3.115: 17 0,0
QFN-24-EP = smd 1.016 x 0.254: 1 -2.066,1.257; 2 -2.066,0.75; 3 -2.066,0.247; 4 -2.066,-0.287; 5 -2.066,-0.792; 6 -2.066,-1.297; 13 2.086,-1.297; 14 2.086,-0.792; 15 2.086,-0.287; 16 2.086,0.247; 17 2.086,0.75; 18 2.086,1.257 | smd 0.254 x 1.016: 7 -1.267,-2.122; 8 -0.762,-2.122; 9 -0.258,-2.122; 10 0.278,-2.122; 11 0.78,-2.122; 12 1.287,-2.122; 19 1.287,2.082; 20 0.78,2.082; 21 0.278,2.082; 22 -0.258,2.082; 23 -0.762,2.082; 24 -1.267,2.082 | smd 2.616 x 2.616: P$1 0.02,-0.01
TPS73633(SOT-23) = smd 0.55 x 1: EN 0.95,-1.35; GND 0,-1.35; IN -0.95,-1.35; NR/FB 0.95,1.35; OUT -0.95,1.35
TPS76850(SOIC-8) = smd 0.55 x 1.5: EN(BAR) -0.635,-2.7; FB/NC -0.635,2.7; GND -1.905,-2.7; IN1 0.635,-2.7; IN2 1.905,-2.7; OUT1 0.635,2.7; OUT2 1.905,2.7; PG -1.905,2.7
6P_HEADER = drill 1.016 pad 1.88: 1 0,0; 2 2.54,0; 3 5.08,0; 4 7.62,0; 5 10.16,0; 6 12.7,0
SPDT = drill 0.8: P$1 -2.5,0; P$3 2.5,0 | drill 0.8 square: P$2 0,0
SPLITTER = smd 0.102 x 0.102: 1 0,0; 2 0,0
SOIC127P600X100-9N = smd 1.525 x 0.7: 1 -2.712,1.905; 2 -2.712,0.635; 3 -2.712,-0.635; 4 -2.712,-1.905; 5 2.712,-1.905; 6 2.712,-0.635; 7 2.712,0.635; 8 2.712,1.905 | smd 2.4 x 3.2: 9 0,0
RASPI_GPIO_B+_PIN = drill 1 pad 1.778 square: 1 -24.13,-1.27 | drill 1 pad 1.778: 2 -24.13,1.27; 3 -21.59,-1.27; 4 -21.59,1.27; 5 -19.05,-1.27; 6 -19.05,1.27; 7 -16.51,-1.27; 8 -16.51,1.27; 9 -13.97,-1.27; 10 -13.97,1.27; 11 -11.43,-1.27; 12 -11.43,1.27; 13 -8.89,-1.27; 14 -8.89,1.27; 15 -6.35,-1.27; 16 -6.35,1.27; 17 -3.81,-1.27; 18 -3.81,1.27; 19 -1.27,-1.27; 20 -1.27,1.27; 21 1.27,-1.27; 22 1.27,1.27; 23 3.81,-1.27; 24 3.81,1.27; 25 6.35,-1.27; 26 6.35,1.27; 27 8.89,-1.27; 28 8.89,1.27; 29 11.43,-1.27; 30 11.43,1.27; 31 13.97,-1.27; 32 13.97,1.27; 33 16.51,-1.27; 34 16.51,1.27; 35 19.05,-1.27; 36 19.05,1.27; 37 21.59,-1.27; 38 21.59,1.27; 39 24.13,-1.27; 40 24.13,1.27

### Placement (x,y rotation side)
3.3V_PWR  10.71,37.89 0 top
5V_PWR  10.74,43.6 0 top
6V_PWR  10.66,32.07 0 top
B1  57.08,63.41 90 top
B2  60.16,30.6 180 top
B3  60.12,24.89 180 top
C1  74.03,42.1 270 top
C2  77.6,51.92 270 top
C4  79.7,51.92 270 top
C7  85.76,31.24 180 top
C8  71.97,42.1 270 top
C17  79.59,31.12 0 top
C18  79.61,28.72 180 top
C21  85.75,28.8 0 top
C22  89.85,50.56 90 top
C23  87.79,50.53 270 top
C_3.3V1  16.32,20.24 0 top
C_3.3V2  16.32,18.07 0 top
C_3.3V5  16.83,29.17 0 top
C_3.3V6  16.79,40.77 0 top
C_3.3V7  16.8,38.72 0 top
C_5V1  18.17,47.7 270 top
C_5V2  20.7,48.88 270 top
C_BAT1  8.75,52.73 90 top
C_BAT2  9.25,48.19 270 top
C_D  63.66,38.56 90 top
C_D1  66.37,38.47 90 top
C_D2  63.66,42.05 270 top
C_E_H1  86.71,17.8 180 top
C_E_H2  98.79,19.05 90 top
C_ELF1  86.97,73.64 270 top
C_ELF2  84.4,73.6 270 top
C_EM_D1  115,41.62 180 top
C_EM_D2  115.03,44.25 0 top
C_ERF1  93.24,18.95 90 top
C_ERF2  96.01,18.97 90 top
C_NR  12.69,24.72 90 top
C_NRST  59.82,58.5 0 top
C_NRST1  64.83,31.4 270 top
C_NRST2  64.79,25.71 270 top
CR1  82.45,43.26 0 top
IMU_C1  95.12,47.48 90 top
IMU_C2  101.13,45.22 0 top
IMU_C3  98.02,47.57 90 top
J1  79.74,65.51 180 top
J2  17.45,65.8 270 top
J3  17.4,58.8 270 top
J4  79.66,62.96 180 top
L1  13.19,20.64 180 top
LEFT_FRONT_EMITTER  91.83,74.05 275 top
NMOS1  81.49,72.25 270 top
NMOS2  120.5,43.44 270 top
NMOS3  82.96,17.72 270 top
NMOS4  107.16,28.49 270 top
R4  92.21,37 270 top
R5  94.73,37.04 270 top
R_B1  79.06,5.27 0 top
R_B2  62,5.19 180 top
R_ED1  111.49,44.25 180 top
R_ED2  118.86,37.19 270 top
R_ED_PD  115.74,49.39 0 top
R_EH1  114.93,46.7 0 top
R_EH2  82.83,20.64 0 top
R_EH_PD  111.54,41.54 180 top
R_ELF  84.33,77.28 90 top
R_ELF_PD  78.39,71.77 90 top
R_ERF  86.56,20.58 0 top
R_ERF_PD  93.16,22.58 270 top
R_PWR1  9.77,41.34 0 top
R_PWR3  9.7,29.78 0 top
R_PWR4  9.75,35.52 0 top
R_RLD  110.62,55.82 180 top
R_RLF  86.86,81.55 0 top
R_RLH  110.5,58.97 180 top
R_RRD  118.38,34.23 0 top
R_RRF  86.65,14.55 180 top
R_RRH  101.6,19.14 90 top
R_VM1  68.12,55.52 180 top
R_VM2  68.08,52.69 0 top
R_VM3  50.31,40.04 180 top
R_VM4  47.73,42.89 180 top
R_VM5  50.85,36.58 270 top
REC_LF  90.8,80.3 273 top
S2  10.16,61.82 0 top
T1  94.74,61.63 90 top
T2  99.49,57.59 90 top
T3  104.48,52.16 90 top
T4  104.35,32.7 90 top
T5  99.65,26.45 90 top
T6  89.88,24.36 90 top
TP7  30.98,52.47 0 top
TP8  30.83,56.41 0 top
TP9  30.97,35.02 0 top
TP10  31.07,30.23 0 top
TP11  30.52,43.09 0 top
TP12  86.85,62.3 90 top
TP13  68.5,75.45 90 top
U2  56.41,40.4 0 top
U6  97.38,42.69 0 top
U$3  16.99,22.78 90 top
U$4  15.07,51.6 270 top
U$5  26.88,39.09 270 top
U$6  27.07,46.94 90 top
U$7  116.9,56.05 320 top
U$8  119.95,31.15 220 top
U$9  90.4,5.38 267 top
U$11  121.6,51.85 322 top
U$13  90.56,11.52 265 top
U$14  75.36,7.8 90 top
U$15  66.03,7.8 90 top
U$16  14.05,72.72 0 top
U$17  122.65,37.65 218 top
U$18  111.28,63.75 0 top
U$19  112.22,24.99 180 top
U$20  106.94,20.33 180 top
U$21  104.53,64.26 0 top
U$22  11.66,71.73 0 top
U$23  18.08,33.95 90 top
X1  4.65,43.1 90 top

### Tracks (layer width: path | path; a pad name or v marks a point on that pad's centre or on a via)
3.3V  (4 unrouted)
  Top 0.254: CR1.1 75.63,47.01 75.38,47.26
  Top 0.305: C22.1 89.84,48.78 CR1.48 88.07,49.4 C23.2 | 77.98,49.6 CR1.64
  Top 0.762: C4.2 C2.2 | C2.2 75.21,51.07 75.12,50.98 | C2.2 77.98,50.69 77.98,49.6
  Top 1.016: J1.4 72.12,65.44 70.34,63.67 70.34,55.76 75.12,50.98 75.12,45.39 75.15,45.35
  pour Top (rank 3): 14.6,22.98 14.6,20.51 10.38,20.51 10.38,12.97 16.2,12.97 16.2,22.98
  pour Top (rank 3): 5.07,48.12 5.07,0.14 97.68,0.14 97.68,48.12
5V  (13 unrouted)
  Top 0.508: U$3.IN 18.41,21.77 18.41,21.73
  Top 0.635: U$3.EN 21.25,23.73
  Top 0.762: 18.41,21.73 19.98,20.16
  Top 1.016: U$4.OUT2 18.61,48.86 21.87,48.86
  Top 1.524: C_5V2.1 20.7,49.16 20.74,49.11
  pour Top: 16.86,54.8 16.86,47.89 24.91,47.89 24.91,54.84 24.79,54.8
  pour Top (rank 5): 16.96,54.95 16.96,47.82 24.86,47.82 138.63,47.82 138.63,94.4 16.93,94.4 16.93,54.42
6V  (1 unrouted)
  Top 0.762: U$23.1 14.27,31.24 14.27,29.47
  Top 1.524: 14.27,29.47 14.27,27.98 15.94,26.3 22.88,26.3 23.77,27.19 23.77,33.06 | 23.77,33.06 24.71,34.01 U$5.3 | 23.77,33.06 23.77,50.79 25,52.02 U$6.3
  pour Top (rank 4): 23.21,88.79 23.21,-3.9 33.6,-3.9 33.6,89.02 23.18,89.02 23.18,88.56
6V_S  (1 unrouted)
A3.3V  (via drill 0.25, 0.3, 1.02)  (2 unrouted)
  Top 0.254: CR1.13 76.77,40.96 75,40.96
  Top 0.305: 74.27,41.01 C1.2 73.81,41.25
  Top 0.508: REC_LF.C 88.75,77.39 | 75,40.96 74.31,40.96 C1.2 | C8.2 69.96,41.25 v69.94,41.26
  Top 1.016: L1.2 12.54,22.29 9.82,22.29 v9.8,22.32
  Top 1.524: C8.2 73.81,41.25
  Bottom 1.524: v9.8,22.32 9.8,17.62 13.1,14.31 16.88,14.31 20.08,17.51 74.11,17.51 87.48,4.14 U$9.C 90.93,5.23 91.65,5.88 91.65,5.95 105.67,19.97 U$20.C 105.78,20.83 107.5,22.54 108.92,22.54 110.63,20.83 110.7,20.83 113.65,23.78 114.2,23.78 118.66,28.23 U$8.C 119.73,30.72 119.87,30.58 122.13,30.58 126.18,34.63 126.18,51.47 122.8,54.85 U$7.C 117.55,63.86 114.45,66.97 109,66.97 U$21.C 101.11,68.45 101.11,73.52 95.62,79.01 REC_LF.C
  other vias: 70.81,21.45 70.81,20.23 70.81,19.06 74.16,21.45 74.16,20.23 74.16,19.01 71.67,40.02 70.68,41.26 74.01,40.02
  pour Bottom: 69.41,41.85 75.79,41.85 75.79,15.84 69.41,15.84
AGND  (via drill 0.51, 1.02)  (13 unrouted)
  Top 0.254: CR1.12 75.55,41.51
  Top 0.305: 74.06,42.92 C1.1
  Top 0.381: 75.55,41.51 74.14,42.92
  Top 0.508: 74.14,42.92 74.06,42.92
  Top 1.016: v11.71,71.71 11.68,71.73 U$22.2 | C1.1 C8.1 70.05,42.95 69.33,43.66 v69.33,43.71
  Top 1.524: R_RLF.1 82.59,83.43 v81.32,83.43 | v11.71,71.71 11.71,71.78 12.69,72.76 | 114.88,62.57 114.88,62.5 R_RLH.1 111.47,58.85 R_RLD.1
  Bottom 1.524: v81.32,83.43 64.84,83.43 58.47,77.05 58.47,70.63 55.95,68.11 45.03,68.11 | 45.03,68.11 18.01,68.11 17.61,68.51 16.19,68.51 15.79,68.11 9.49,68.11 9.49,69.49 v11.71,71.71 | 45.03,63.87 45.03,61.46 52.93,53.56 59.48,53.56 v69.33,43.71 | 45.03,62.19 45.03,68.11
  pour Bottom: 94.2,50.28 94.2,10.05 102.05,10.05 102.05,50.28
BOOT0  (1 unrouted)
BOOT1  (1 unrouted)
BRIDGE_A_1
  Top 0.254: U2.16 61.17,42.67 61.84,43.34 61.84,43.91 62.41,44.48 65.52,44.48 70.59,39.41 74.76,39.41 75.36,40.01 CR1.15
BRIDGE_A_2
  Top 0.254: U2.15 61.27,42.02 62.35,43.1 62.35,43.7 62.62,43.98 65.03,43.98 70.1,38.9 75.35,38.9 75.96,39.51 CR1.16
BRIDGE_B_1  (via drill 0.25, 0.3)
  Top 0.254: CR1.26 83.2,36.47 83.69,35.98 v83.69,35.14 | 59.76,35.07 60.37,35.07 60.57,34.86 79.34,34.86 v79.4,34.81
  Top 0.305: U2.9 59.43,38.12 59.76,37.79 59.76,35.07
  Bottom 0.254: v83.69,35.14 83.66,35.12 79.7,35.12 v79.4,34.81
BRIDGE_B_2  (via drill 0.25, 0.3)
  Top 0.254: CR1.27 83.7,36.63 84.27,36.06 84.27,35.9 v84.29,35.9 | v78.89,35.5 60.73,35.5
  Top 0.305: U2.10 59.31,38.73 60.17,38.73 60.73,38.18 60.73,35.5
  Bottom 0.254: 84.29,35.78 v84.29,35.9 84.19,35.8 83.96,35.8 79.59,35.8 | 79.59,35.8 | 79.59,35.8 79.19,35.8 v78.89,35.5
D2_EM  (1 unrouted)
  Top 1.016: U$17.- 120.41,36.34 R_ED2.2 113.35,36.34 112.21,37.48
D_EM  (1 unrouted)
  Top 0.508: U$11.- 117.48,50.68 115.85,52.3 114.15,52.3 108.25,46.4 104.7,46.4 | 105.55,40.05 106.77,38.83 112.69,38.83
  Top 1.016: U$17.+ 122.12,40.04 113.9,40.04 112.69,38.83
EM_D  (2 unrouted)
EM_H  (2 unrouted)
EM_LF  (2 unrouted)
EM_RF  (2 unrouted)
GND  (via drill 0.25, 0.3, 0.51)  (39 unrouted)
  Top 0.305: C23.1 87.32,51.38
  Top 0.508: U$3.GND 20.49,22.78 v20.49,22.72
  Top 0.762: 18.71,32.75 U$23.3 | U$23.3 U$23.4 19.98,29.17 19.4,29.17 | C_3.3V5.2 19.4,29.17 | 19.4,29.17 v19.4,29.15 18.71,29.15 U$23.3
  Top 1.016: 12.65,72.72 U$22.1 16.59,66.8 J2.2 | C_BAT1.2 12.37,53.58 U$4.EN(BAR) | U$4.GND 12.95,53.51 12.95,52.21 | 6V_PWR.C 12.16,43.52 5V_PWR.C | v12.62,28.11 12.69,28.11 C_NR.2
  Top 1.524: U$16.1 12.65,72.72 | C_5V2.2 20.7,40.83 v20.16,40.83
  other vias: 9.52,55.41 9.54,54.65 8.1,55.46 8.07,54.67 14.17,42.58 14.17,43.63 14.17,44.62 10.13,45.4 8.45,45.35 19.07,40.78 20.11,38.75 19.02,38.8 77.13,54.47 77.95,54.47 79.39,54.47 80.23,54.5 87.29,52.57 88.16,52.54 89.27,52.59 90.21,52.59
  pour Bottom (rank 2): -3,91.25 135.7,91.25 135.7,-4.75 -3,-4.75
  pour Top: 8.55,53.05 7.66,53.05 7.66,55.84 9.95,55.84 9.95,53.13 8.55,53.13
  pour Top: 11.25,45.12 14.52,45.12 14.52,42.18 11.25,42.18
  pour Top: 10.58,48.17 10.58,44.95 7.94,44.95 7.94,48.17
  pour Top: 17.24,41.54 17.24,37.73 20.95,37.73 20.95,41.54
  pour Top: 17.06,37.61 19.3,37.61 19.3,35.32 20.8,35.32 20.8,27.42 16.88,27.42 16.88,30.16 18.18,30.16 18.18,32.5 14.47,32.5 14.47,35.35 17.04,35.35 17.04,37.63
  pour Top: 76.52,52.16 80.79,52.16 80.79,55.51 76.52,55.51
  pour Top: 86.71,53.33 91.08,53.33 91.08,50.69 86.71,50.69
H2_EM  (2 unrouted)
  Top 0.508: U$19.- 110.95,30.25 102.95,38.25
H_EM  (1 unrouted)
  Top 0.508: U$18.- 109.28,59.98 108.89,59.98 108.59,59.68 108.59,59.29 104.3,55 100.85,55 98.95,53.1 98.15,53.1
I2C_SCL  (2 unrouted)
I2C_SDA  (2 unrouted)
INT  (1 unrouted)
  Top 0.254: CR1.56
LF_EM  (1 unrouted)
  Top 0.508: LEFT_FRONT_EMITTER.- 89.7,71 89.7,67.85
M1_A
  Top 0.305: 51.64,42.88 51.5,43.02
  Top 0.381: U2.2 52.5,42.02 51.64,42.88
  Top 0.508: 39.18,46.94 U$6.1
  Top 1.524: 51.64,42.88 47.58,46.94 U$6.1
M1_B  (1 unrouted)
M1_ENC_A  (via drill 0.35)  (1 unrouted)
  Top 0.254: CR1.37 90.39,41.51 | 90.39,41.51 90.4,41.5 | 90.39,41.51 91.41,41.51 93.5,43.6 93.5,53.2 94.4,54.1 94.4,56.4 v94.18,56.62
  Top 1.016: U$6.4 28.89,54.56 TP7.P$1
  Bottom 0.254: v94.18,56.62 94.1,56.7 81.25,56.7
M1_ENC_B  (via drill 0.35)  (1 unrouted)
  Top 0.254: CR1.38 90.39,42.01 | 90.39,42.01 90.4,42 | 90.39,42.01 91.11,42.01 92.95,43.85 v92.95,55.37
  Top 1.016: U$6.5 30.13,57.1 TP8.P$1
  Bottom 0.254: v92.95,55.37 92.62,55.7 81.25,55.7
M2_A
  Top 0.381: U2.7 47.67,38.77
  Top 1.524: 47.67,38.77 26.88,38.77 U$5.1
M2_B  (1 unrouted)
M2_ENC_A  (via drill 0.35)  (1 unrouted)
  Top 0.254: CR1.40 90.39,43.01 | 90.39,43.01 90.4,43 | 90.39,43.01 91.55,44.17 91.55,52.67 v91.62,52.67
  Top 0.508: TP9.P$1 27.42,31.47 U$5.4
  Bottom 0.254: v91.62,52.67 90.99,53.3 81.25,53.3
M2_ENC_B  (via drill 0.35)  (1 unrouted)
  Top 0.254: CR1.39 90.39,42.51 | 90.39,42.51 90.74,42.51 92.25,44.02 92.25,53.94 v92.12,53.94 | 90.39,42.51 90.4,42.5
  Top 0.508: U$5.5 28.18,30.23 TP10.P$1
  Bottom 0.254: 92.07,53.89 v92.12,53.94 91.91,54.15 81.2,54.15
MGND  (2 unrouted)
  Top 0.305: U2.13 59.26,40.7
  Top 0.381: U2.13 61.84,40.72 61.84,40.45 | 59.26,40.7 57.87,40.7
  Top 1.016: U$16.2 17.2,72.72 17.55,72.38 17.55,72.34 20.38,69.5 | C_D.2 62.88,39.41 61.84,40.45 | C_D.2 66.28,39.41 C_D1.2 | C_D2.2 C_D.2
  Top 1.524: U$16.2 17.16,72.72 20.38,69.5 21.77,68.11 21.77,64.94 U$6.6
  pour Top (rank 2): 25.49,48.25 25.49,24.8 56.2,24.8 56.2,34.48 67.38,34.48 67.38,48.32 25.47,48.32
N$1
  Top 0.508: R_PWR4.1 7.89,36.53 7.89,37.53 8.25,37.89 3.3V_PWR.A
N$2
  Top 0.305: U2.3 53.53,41.36 50.1,41.36 R_VM4.1
N$3
  Top 1.016: J3.2 16.85,64.75 J2.1
N$4
  Top 1.016: R_B2.1 62.96,5.3 U$15.P$1
N$5  (1 unrouted)
N$6
  Top 1.016: U$14.P$1 78.17,5.3 R_B1.1
N$7  (1 unrouted)
N$8
  Top 0.305: U2.6 53.52,39.41 51.79,39.41 R_VM3.1
N$9
  Top 0.254: 7.93,31.75 7.96,31.78
  Top 0.508: R_PWR3.1 7.93,30.69 7.93,31.75 | 7.96,31.78 8.25,32.07 6V_PWR.A
N$10  (1 unrouted)
  Top 0.305: C_D1.1 63.75,37.62 C_D.1 63.03,37.71 60.68,40.06 U2.12 59.28,39.98
  Top 0.508: 66.28,37.71 C_D1.1
N$11
  Top 0.305: U2.11 60.35,39.42 63.39,36.39 66.69,36.39 68.7,38.39 68.7,39.38 65.19,42.9 C_D2.1 62.14,41.37 U2.14
N$14
  Top 0.508: 5V_PWR.A 8.35,43.6 7.87,43.12 7.87,41.72 8.25,41.34 R_PWR1.1
N$15  (via drill 0.25)
  other vias: 69.97,38.09
N$16  (via drill 0.25)
  other vias: 70.63,38.09
N$17  (via drill 0.25)
  other vias: 75.2,37.91
N$18  (2 unrouted)
N$19  (2 unrouted)
N$20  (via drill 0.25)
  other vias: 74.39,37.86
N$26  (1 unrouted)
N$28  (1 unrouted)
N$29  (1 unrouted)
NFAULT  (1 unrouted)
  Top 0.305: U2.8 51.54,38.12 R_VM5.1
PRGM_1  (3 unrouted)
PRGM_2  (3 unrouted)
REC_LD  (3 unrouted)
  Top 0.254: CR1.23 81.7,33.61
  Top 0.508: U$7.E 110.05,50.93 110.05,50.67 107.29,47.9 104.65,47.9
REC_LF  (2 unrouted)
  Top 0.254: CR1.22 81.2,33.32
  Top 1.016: REC_LF.E R_RLF.2
REC_LH  (3 unrouted)
  Top 0.508: U$21.E 103.26,56.71 102.46,55.91 100.18,55.91 99.12,54.85 98.65,54.85
REC_RD  (3 unrouted)
  Top 0.254: CR1.24 82.2,33.89
  Top 0.508: 103.75,40.2 106.75,37.21 106.75,35.87 110.26,32.35 U$8.E
REC_RF  (3 unrouted)
  Top 0.305: CR1.25 82.7,34.11
  Top 0.508: U$9.E 84.5,12.15 83.7,12.15 78.3,17.55 78.3,24.15
REC_RH  (3 unrouted)
  Top 0.508: U$20.E 102.45,26.58 102.45,37 101.75,37.7
RESET  (via drill 0.25)
  Top 0.254: B1.3 59.09,60.52 | C_NRST.1 58.81,58.34 | C_NRST.1 58.88,58.42 | CR1.7 76.8,44.03 72.23,44.03 v71.01,45.25 | v58.97,57.06 C_NRST.1 | C_NRST.1 58.98,58.52 B1.3 | B1.4 B1.3
  Bottom 0.254: v71.01,45.25 59.2,57.06 v58.97,57.06
RF_EM  (1 unrouted)
  Top 0.508: U$13.- 86.71,13.54 83.95,13.54 79.7,17.79 79.7,24.1
SPI2_MISO  (1 unrouted)
SPI2_MOSI  (1 unrouted)
SPI2_NSS  (1 unrouted)
SPI2_SCK  (1 unrouted)
SWCLK  (1 unrouted)
SWDIO  (1 unrouted)
USART1_RX  (2 unrouted)
USART1_TX  (2 unrouted)
V_BATT  (4 unrouted)
  Top 1.016: C_3.3V6.1 16.17,40.77 U$23.8 16.17,35.97
  pour Top (rank 2): 20.08,63.11 20.08,55.36 13.12,55.36 13.12,49.14 7.66,49.14 7.66,63.13
  pour Top (rank 6): -1.3,88.89 -1.3,-3.92 22.52,-3.92 22.52,88.89
VBAT_POWER
  Top 1.016: J3.1 15.37,59.28 S2.3
VBAT_SENSE  (2 unrouted)

### Text on the board
tPlace: GND | 3.3V
tNames: GND | MGND | AGND | PWR SWITCh | 1 | OFF | BAT 1 | RESET | Serial Wire | - | AGND | 2 | + | - | USART | ON | BAT 2 | + | M1 ENC B | MOTOR 1 | 3 | M1 ENC A | MOTOR CTRL | MGND | IMU | 4 | M2 ENC A | M2 ENC B | PRGM 1 | MOTOR2 | PRGM 2 | 5 | L | 6 | BOOT1 | BOOT0
Document: Notes / ----------------------- / Bottom layer - GND / Add net classes / Add power planes / Use vector font